# EasyEDA Pro project Drone.eprj, schematic Schematic1, sheets 2 to 4 of 9

## Sheets
2 Memories: Create Date: 2025-06-16; Page Name: Memories; Update Date: 2025-07-30
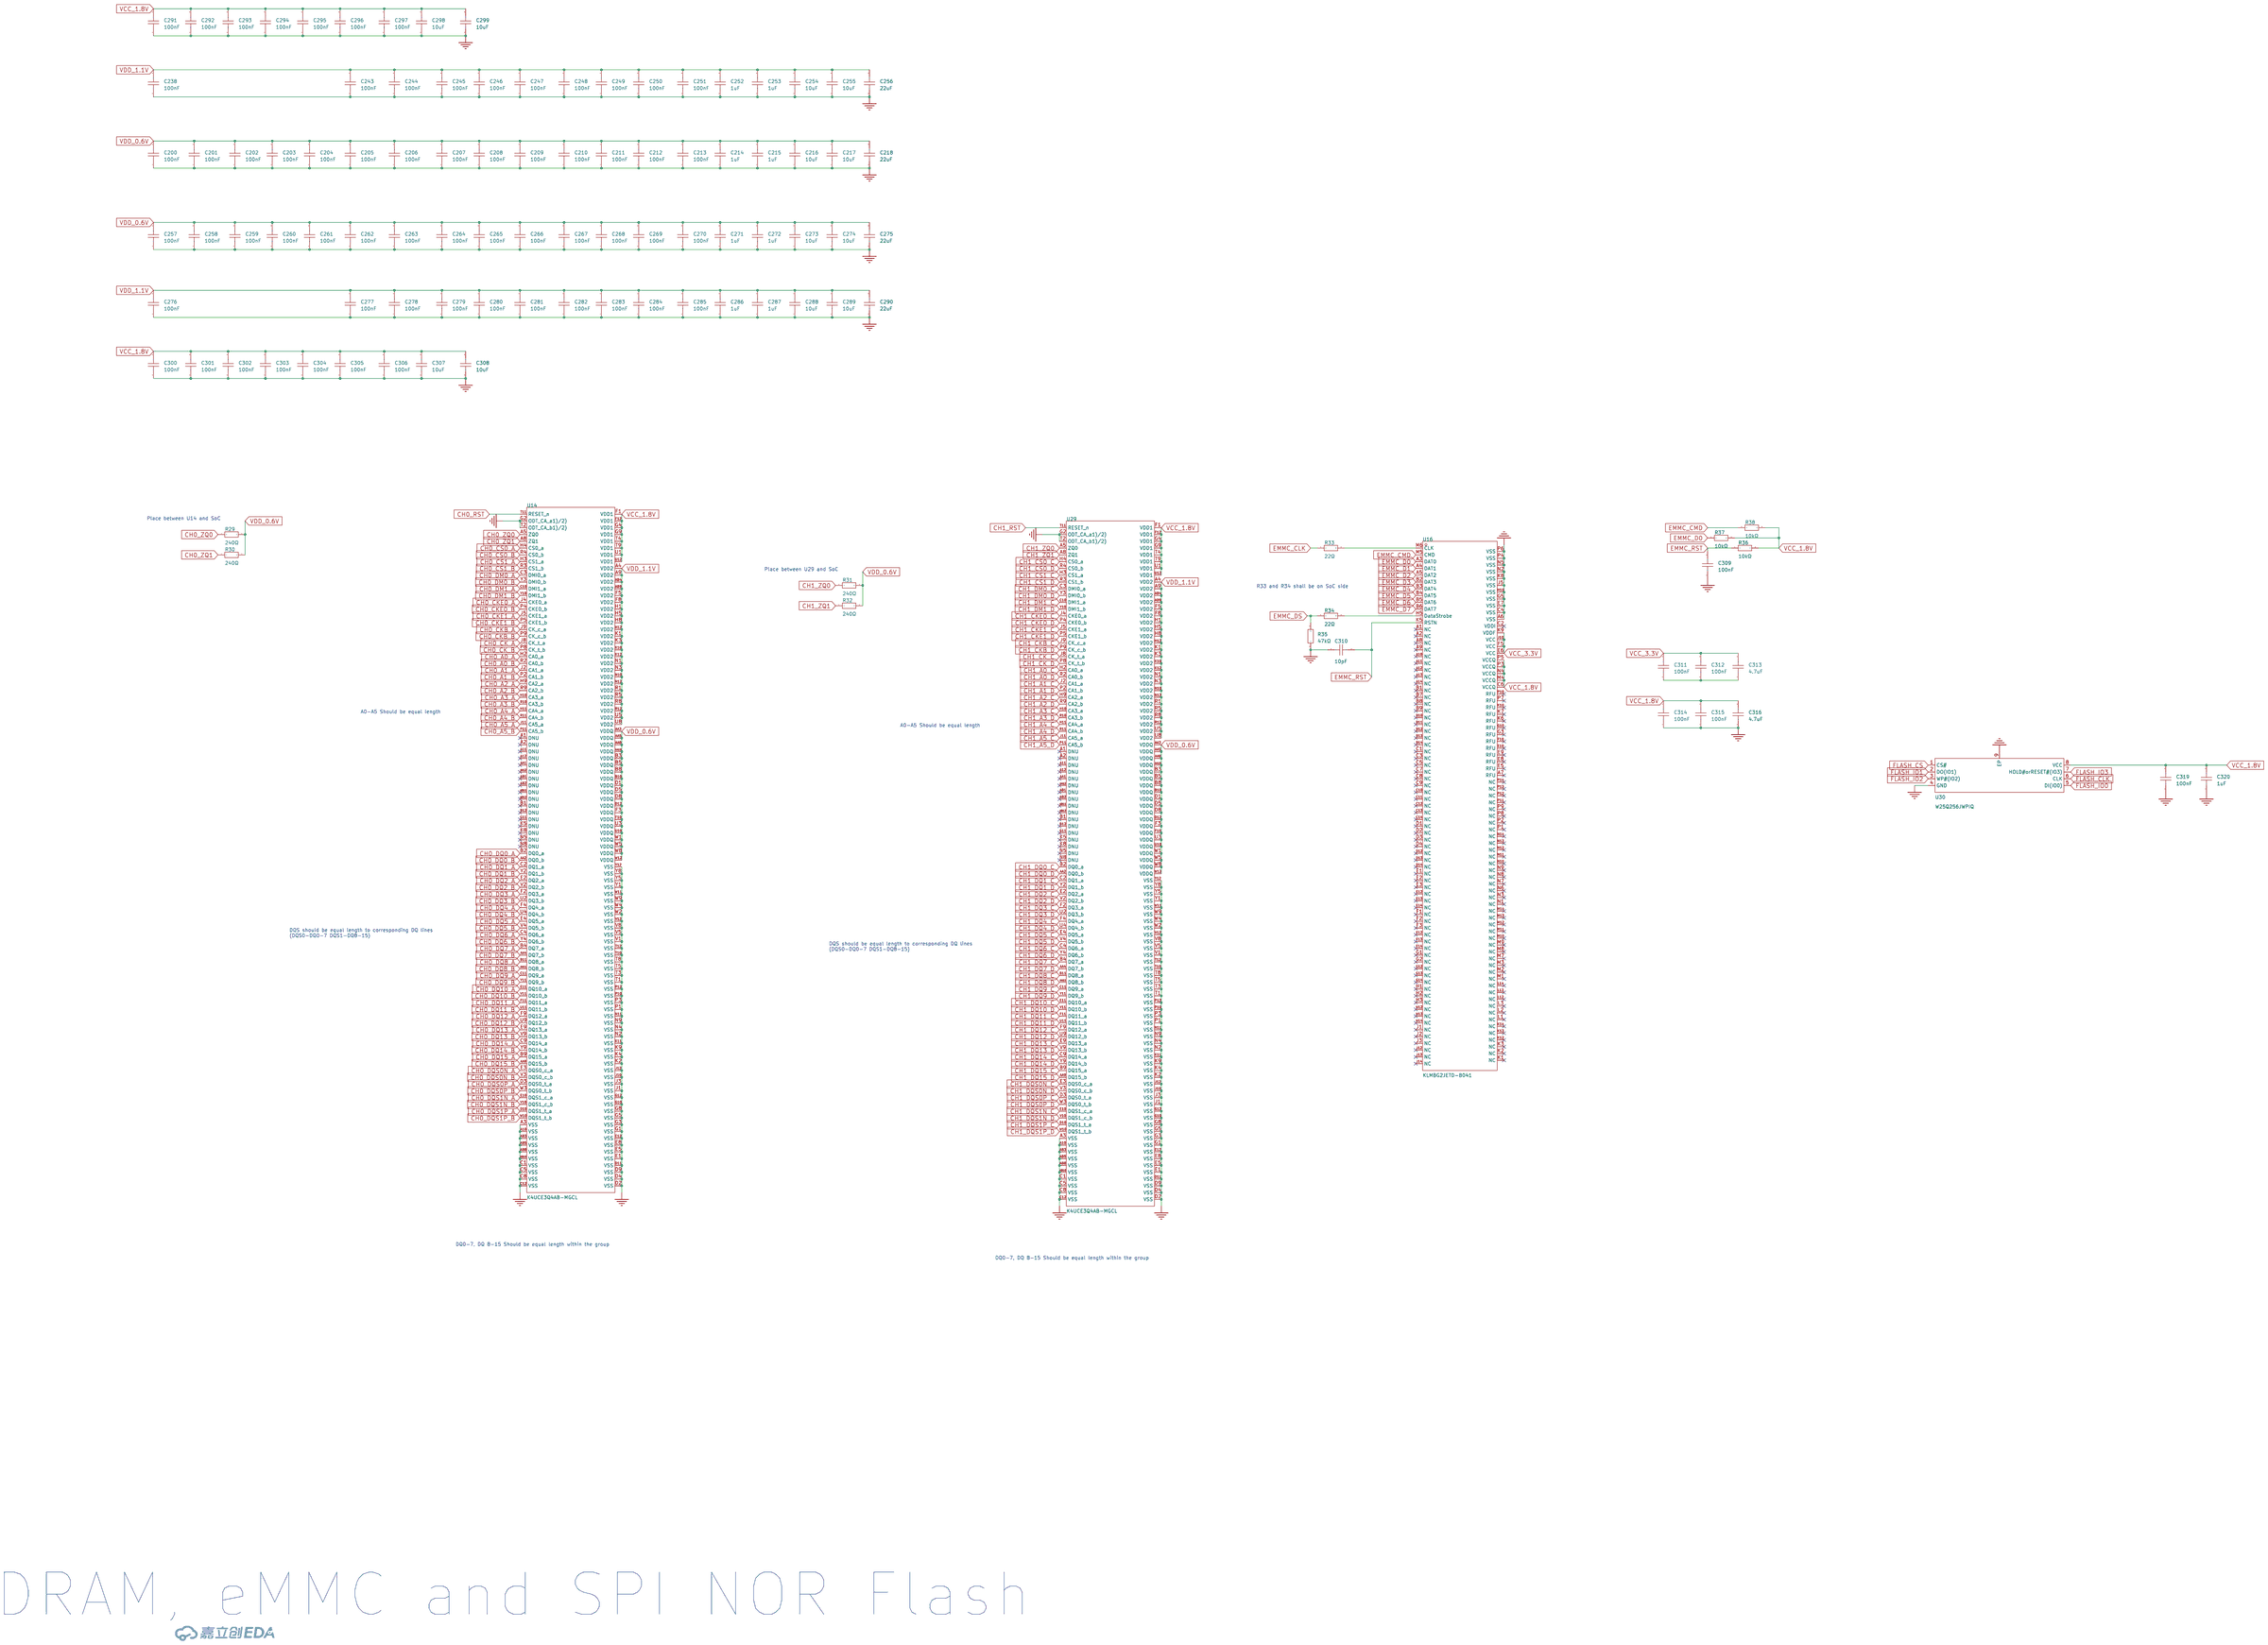
[diagram p1: Memories]
3 RTC and Crystal: Create Date: 2025-06-16; Page Name: RTC and Crystal; Update Date: 2025-07-29
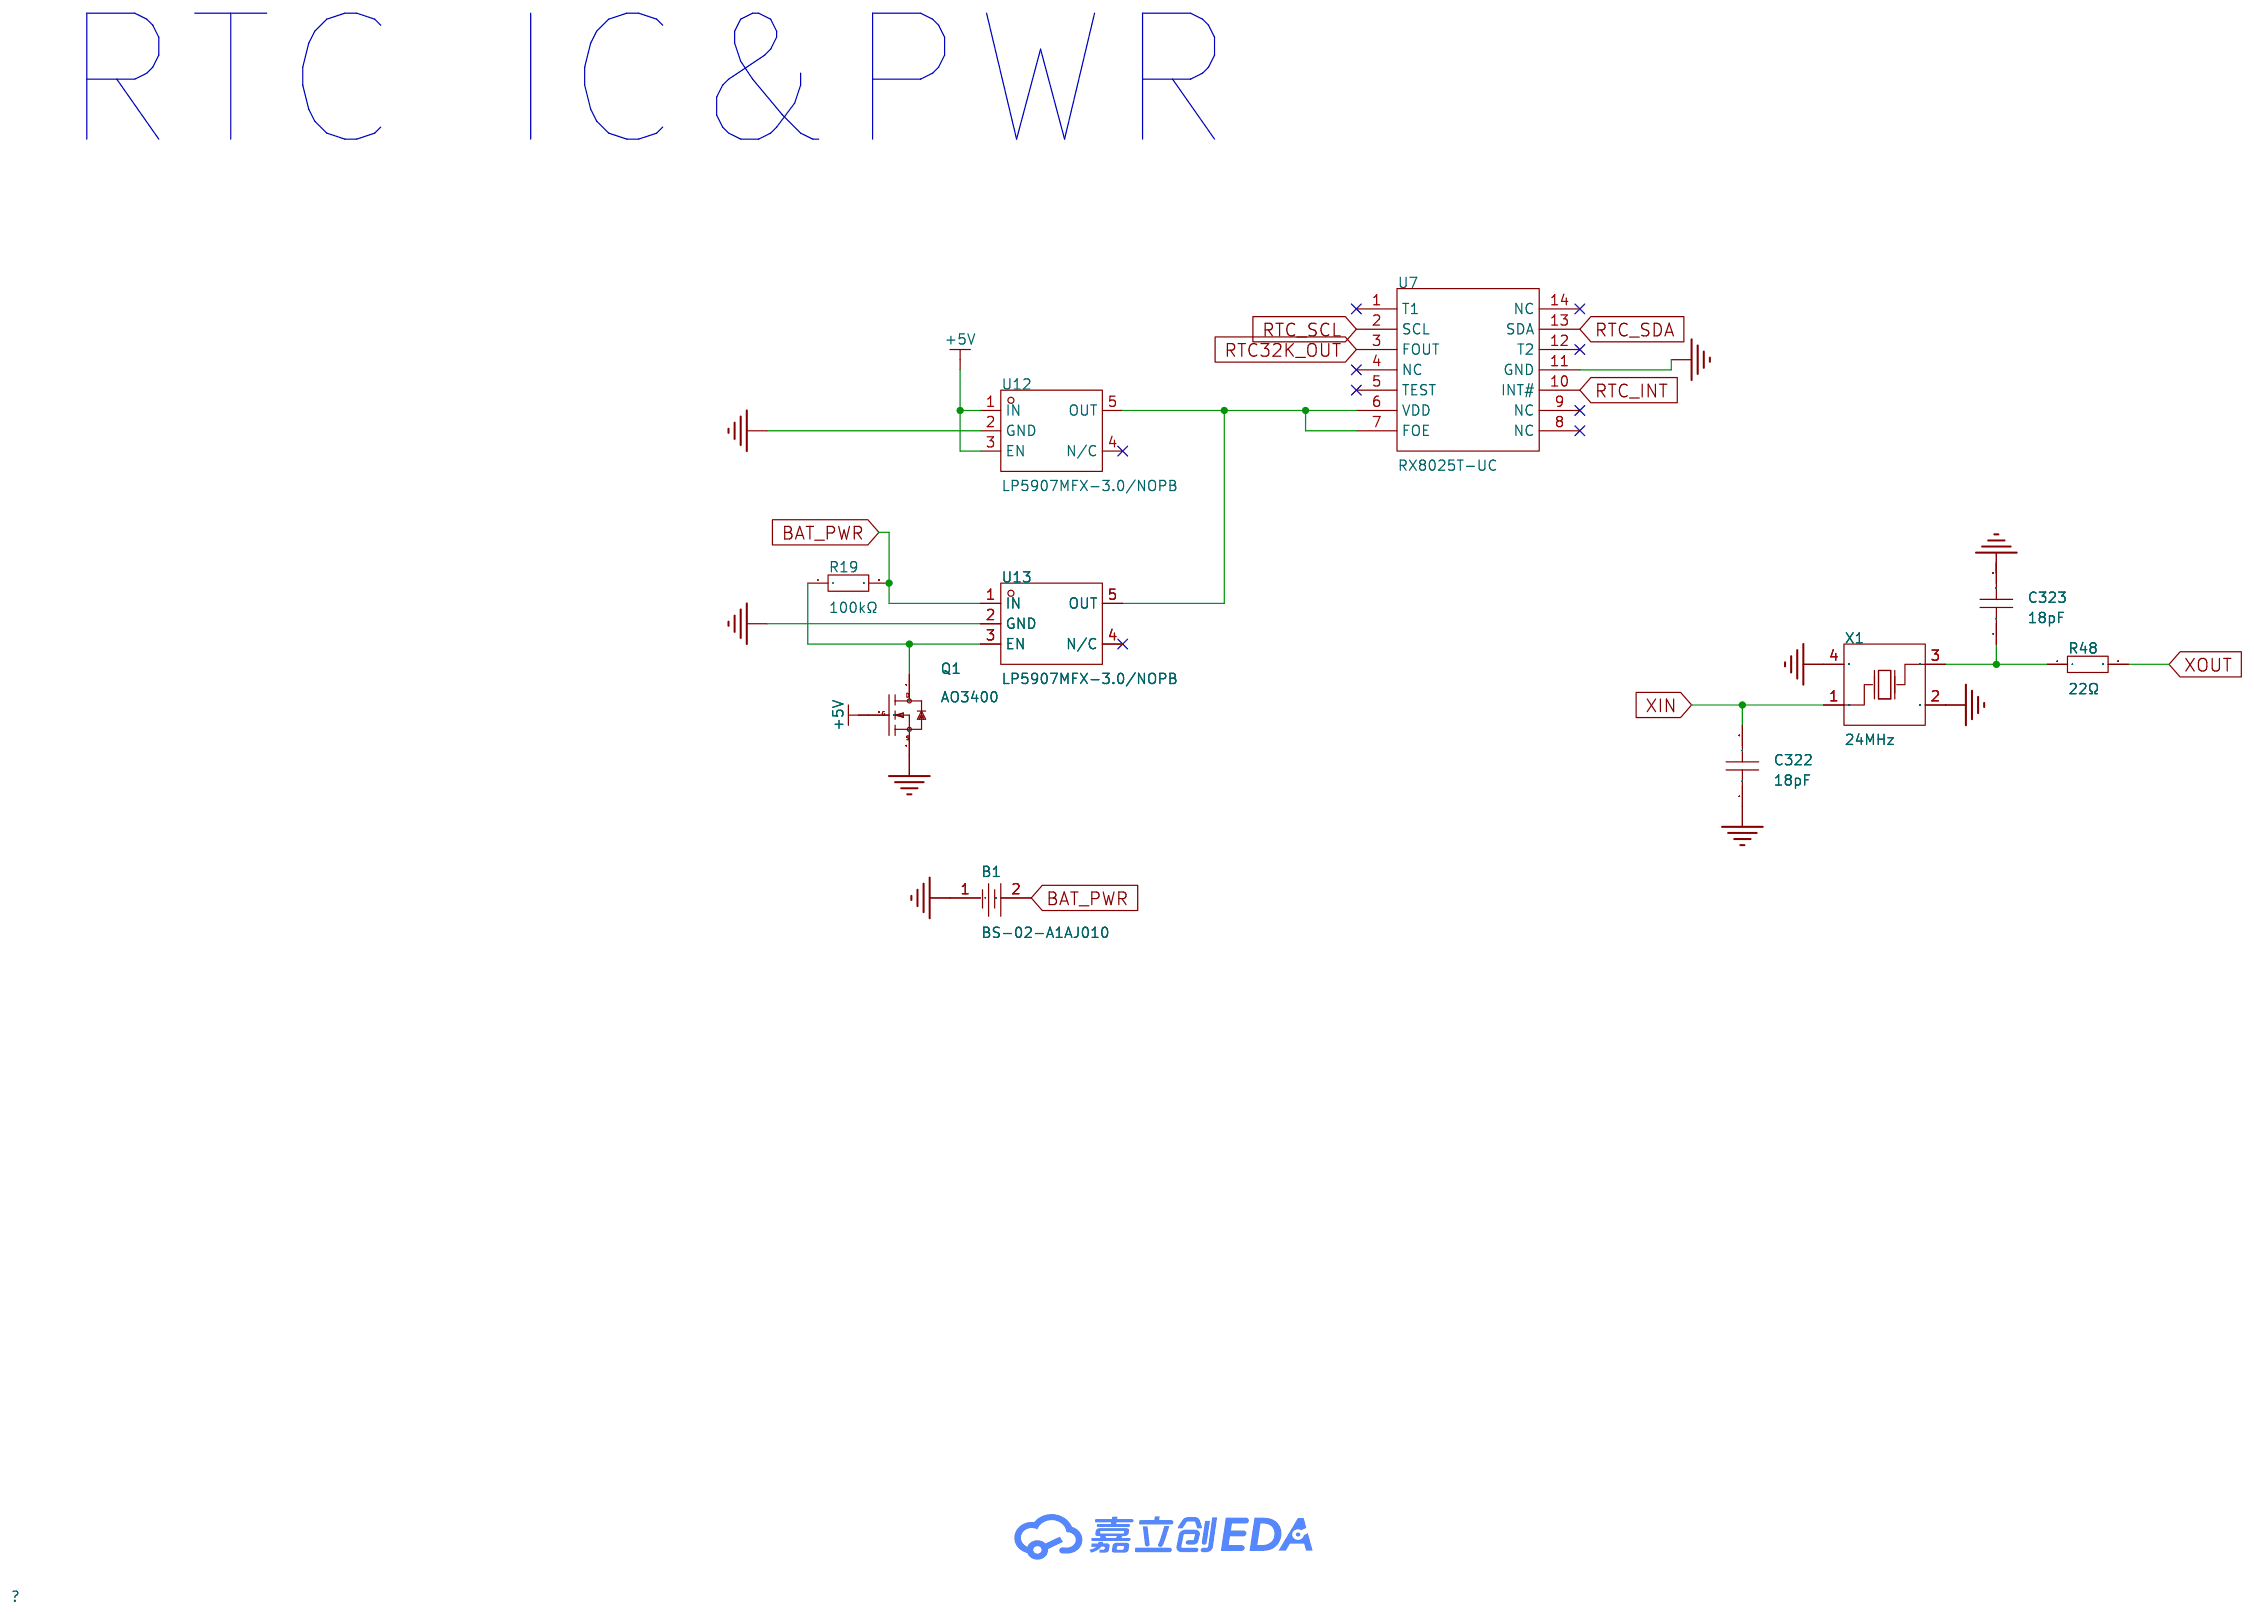
[diagram p2: RTC and Crystal]
4 Main Power ICs: Create Date: 2025-06-17; Page Name: Main Power ICs; Update Date: 2025-08-09
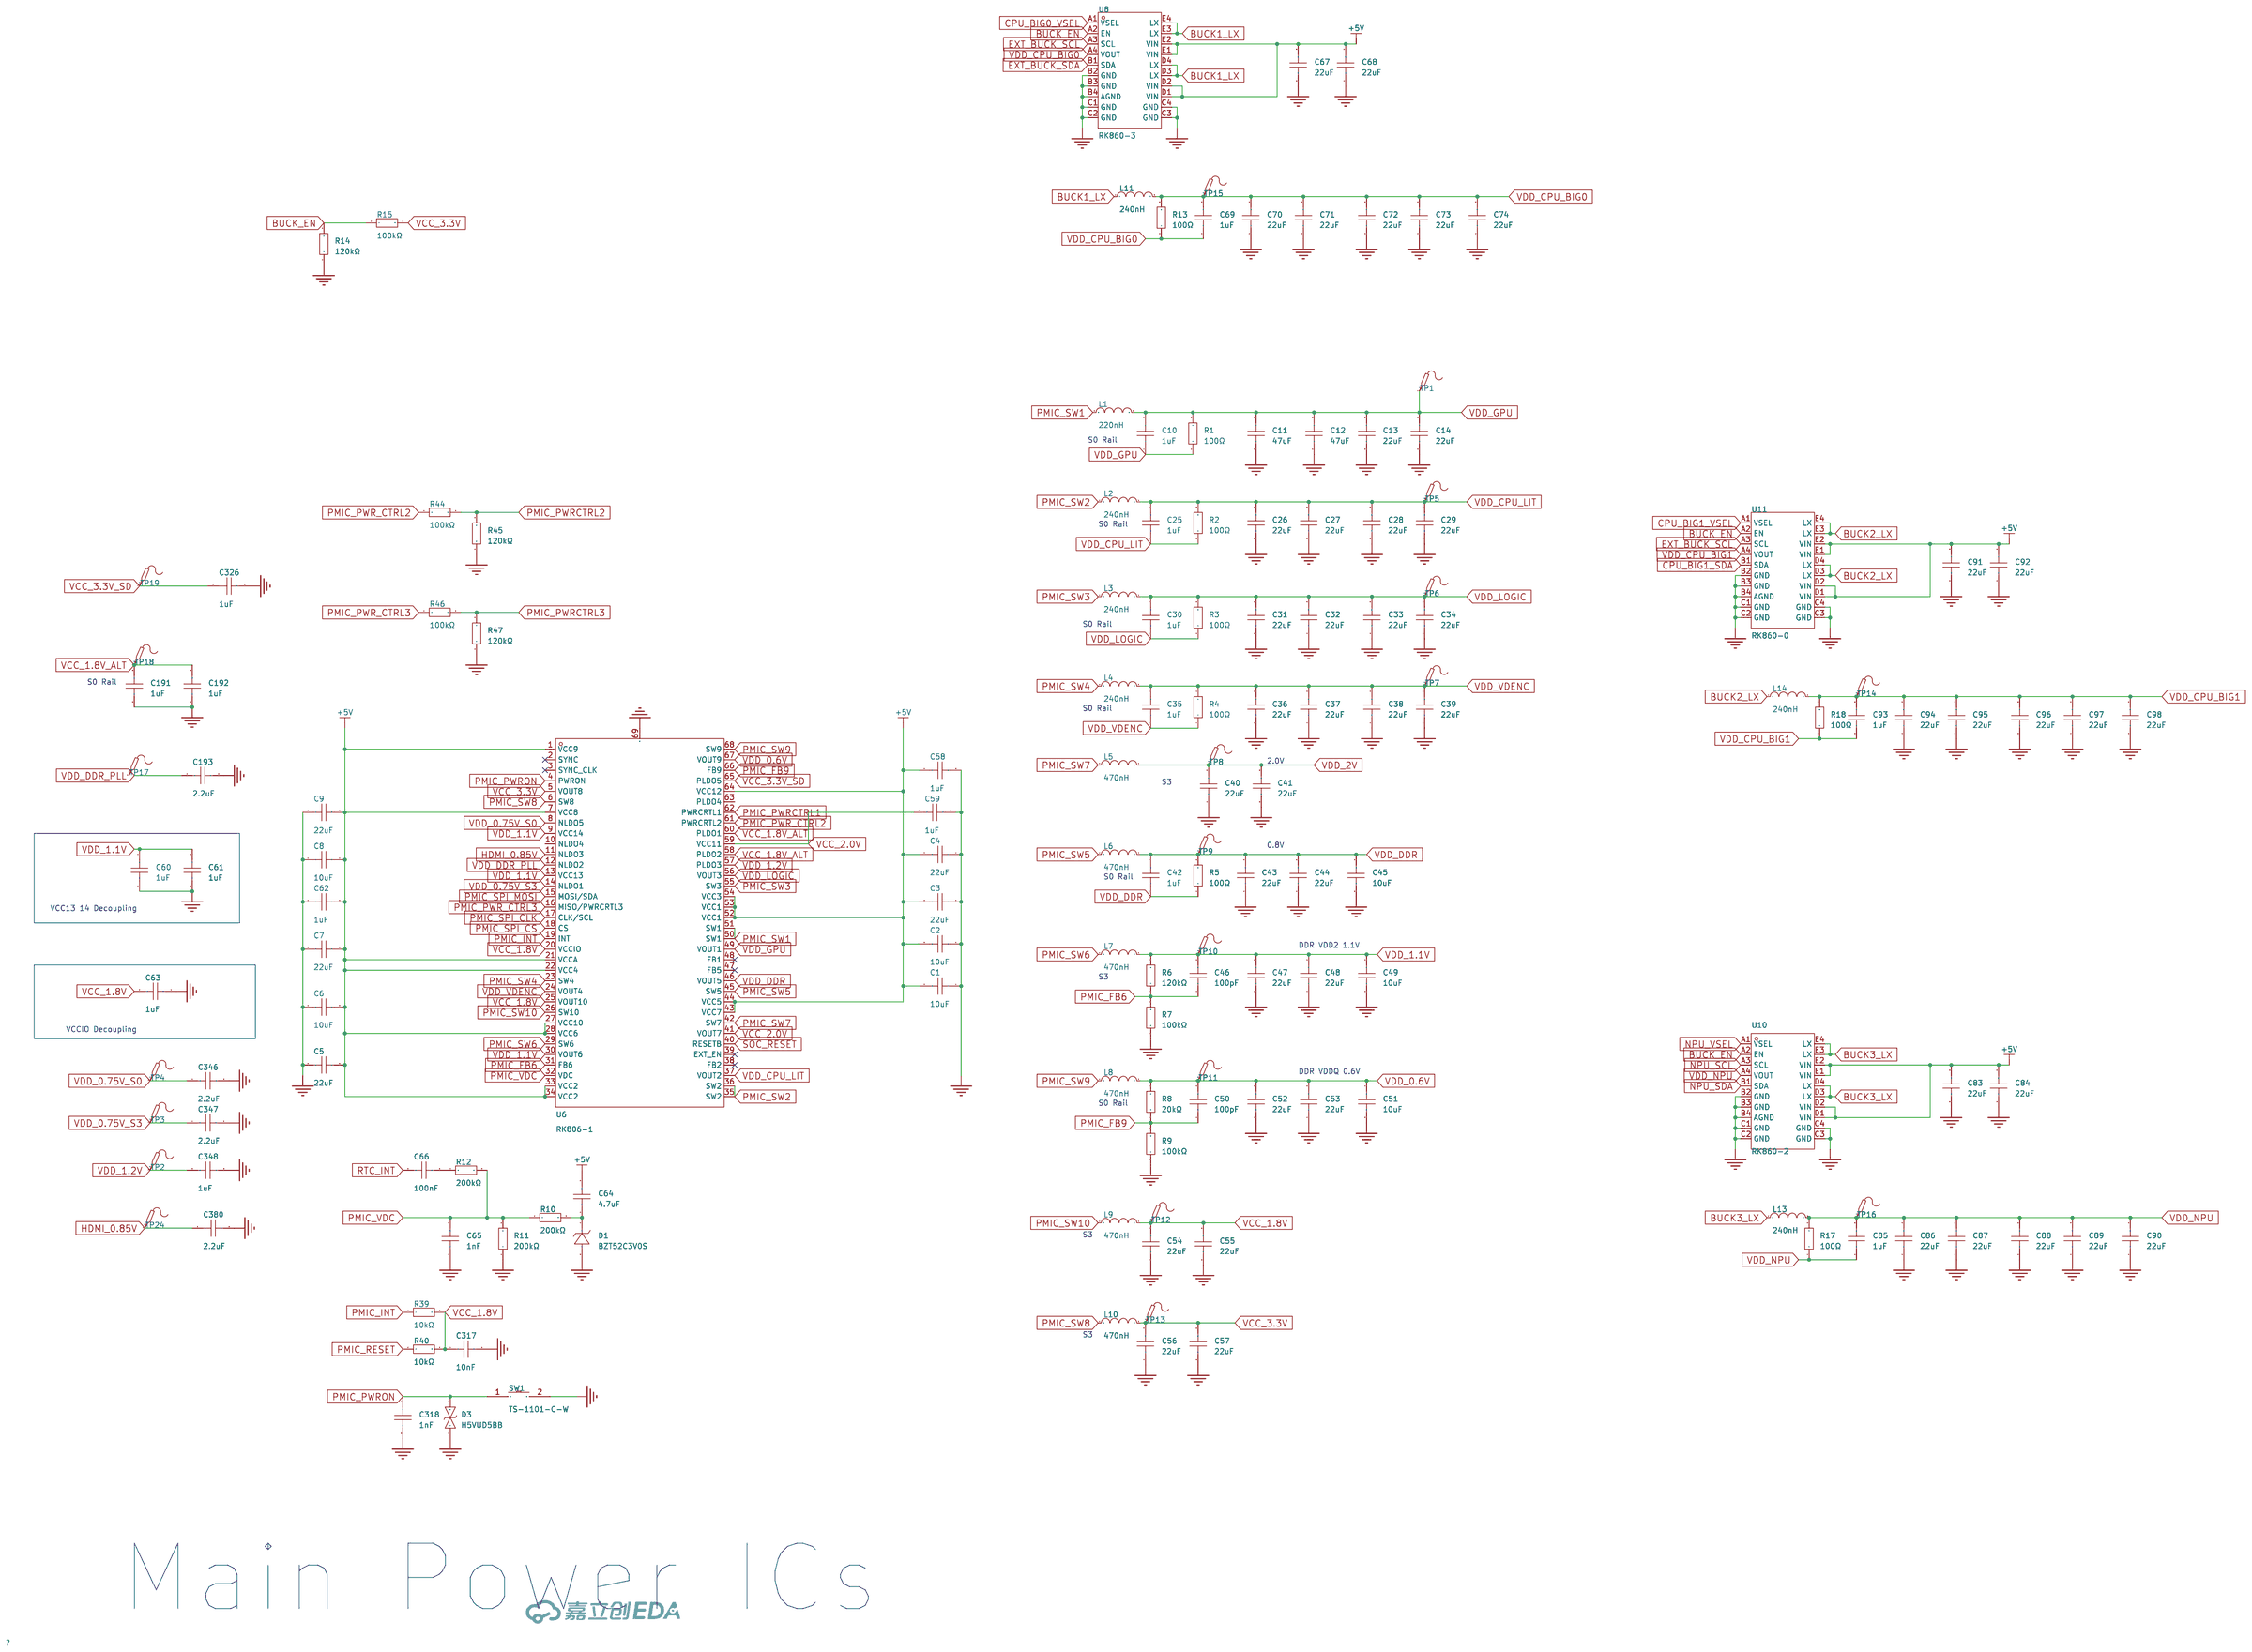
[diagram p3: Main Power ICs]

## Parts
sheet Main Power ICs
C1  10uF  [C0402]
C2  10uF  [C0402]
C3  22uF  [C0402]
C4  22uF  [C0402]
C5  22uF  [C0402]
C6  10uF  [C0402]
C7  22uF  [C0402]
C8  10uF  [C0402]
C9  22uF  [C0402]
C10  1uF  [C0201]
C11  47uF  [C0603]
C12  47uF  [C0603]
C13  22uF  [C0402]
C14  22uF  [C0402]
C25  1uF  [C0201]
C26  22uF  [C0402]
C27  22uF  [C0402]
C28  22uF  [C0402]
C29  22uF  [C0402]
C30  1uF  [C0201]
C31  22uF  [C0402]
C32  22uF  [C0402]
C33  22uF  [C0402]
C34  22uF  [C0402]
C35  1uF  [C0201]
C36  22uF  [C0402]
C37  22uF  [C0402]
C38  22uF  [C0402]
C39  22uF  [C0402]
C40  22uF  [C0402]
C41  22uF  [C0402]
C42  1uF  [C0201]
C43  22uF  [C0402]
C44  22uF  [C0402]
C45  10uF  [C0402]
C46  100pF  [C01005]
C47  22uF  [C0402]
C48  22uF  [C0402]
C49  10uF  [C0402]
C50  100pF  [C01005]
C51  10uF  [C0402]
C52  22uF  [C0402]
C53  22uF  [C0402]
C54  22uF  [C0402]
C55  22uF  [C0402]
C56  22uF  [C0402]
C57  22uF  [C0402]
C58  1uF  [C0201]
C59  1uF  [C0201]
C60  1uF  [C0201]
C61  1uF  [C0201]
C62  1uF  [C0201]
C63  1uF  [C0201]
C64  4.7uF  [C0201]
C65  1nF  [C0201]
C66  100nF  [C01005]
C67  22uF  [C0402]
C68  22uF  [C0402]
C69  1uF  [C0201]
C70  22uF  [C0402]
C71  22uF  [C0402]
C72  22uF  [C0402]
C73  22uF  [C0402]
C74  22uF  [C0402]
C83  22uF  [C0402]
C84  22uF  [C0402]
C85  1uF  [C0201]
C86  22uF  [C0402]
C87  22uF  [C0402]
C88  22uF  [C0402]
C89  22uF  [C0402]
C90  22uF  [C0402]
C91  22uF  [C0402]
C92  22uF  [C0402]
C93  1uF  [C0201]
C94  22uF  [C0402]
C95  22uF  [C0402]
C96  22uF  [C0402]
C97  22uF  [C0402]
C98  22uF  [C0402]
C191  1uF  [C0201]
C192  1uF  [C0201]
C193  2.2uF  [C0201]
C317  10nF  [C0201]
C318  1nF  [C0201]
C326  1uF  [C0201]
C346  2.2uF  [C0201]
C347  2.2uF  [C0201]
C348  1uF  [C0201]
C380  2.2uF  [C0201]
D1  BZT52C3V0S  [SOD-323_L1.7-W1.3-LS2.6-RD]
D3  H5VUD5BB  [SOD-523_L1.2-W0.8-LS1.6-BI]
L1  220nH  [IND-SMD_L3.2-W2.5_SRP3212]
L2  240nH  [IND-SMD_L2.5-W2.0_MHCHL2520]
L3  240nH  [IND-SMD_L2.5-W2.0_MHCHL2520]
L4  240nH  [IND-SMD_L2.5-W2.0_MHCHL2520]
L5  470nH  [IND-SMD_L2.5-W2.0]
L6  470nH  [IND-SMD_L2.5-W2.0]
L7  470nH  [IND-SMD_L2.5-W2.0]
L8  470nH  [IND-SMD_L2.5-W2.0]
L9  470nH  [IND-SMD_L2.5-W2.0]
L10  470nH  [IND-SMD_L2.5-W2.0]
L11  240nH  [IND-SMD_L2.5-W2.0_MHCHL2520]
L13  240nH  [IND-SMD_L2.5-W2.0_MHCHL2520]
L14  240nH  [IND-SMD_L2.5-W2.0_MHCHL2520]
R1  100Ω  [R0201]
R2  100Ω  [R0201]
R3  100Ω  [R0201]
R4  100Ω  [R0201]
R5  100Ω  [R0201]
R6  120kΩ  [R0201]
R7  100kΩ  [R0201]
R8  20kΩ  [R0201]
R9  100kΩ  [R0201]
R10  200kΩ  [R0201]
R11  200kΩ  [R0201]
R12  200kΩ  [R0201]
R13  100Ω  [R0201]
R14  120kΩ  [R0201]
R15  100kΩ  [R0201]
R17  100Ω  [R0201]
R18  100Ω  [R0201]
R39  10kΩ  [R0201]
R40  10kΩ  [R0201]
R44  100kΩ  [R0201]
R45  120kΩ  [R0201]
R46  100kΩ  [R0201]
R47  120kΩ  [R0201]
SW1  TS-1101-C-W  [SW-SMD_L6.0-W3.3-LS8.0]
TP1  -  [Test-Point-0.5mm]
TP2  -  [Test-Point-0.5mm]
TP3  -  [Test-Point-0.5mm]
TP4  -  [Test-Point-0.5mm]
TP5  -  [Test-Point-0.5mm]
TP6  -  [Test-Point-0.5mm]
TP7  -  [Test-Point-0.5mm]
TP8  -  [Test-Point-0.5mm]
TP9  -  [Test-Point-0.5mm]
TP10  -  [Test-Point-0.5mm]
TP11  -  [Test-Point-0.5mm]
TP12  -  [Test-Point-0.5mm]
TP13  -  [Test-Point-0.5mm]
TP14  -  [Test-Point-0.5mm]
TP15  -  [Test-Point-0.5mm]
TP16  -  [Test-Point-0.5mm]
TP17  -  [Test-Point-0.5mm]
TP18  -  [Test-Point-0.5mm]
TP19  -  [Test-Point-0.5mm]
TP24  -  [Test-Point-0.5mm]
U6  RK806-1  [QFN-68_L7.0-W7.0-P0.35-BL-EP5.5]
U8  RK860-3  [WLCSP-20_L2.0-W1.6-R5-C4-P0.40-TL]
U10  RK860-2  [WLCSP-20_L2.0-W1.6-R5-C4-P0.40-TL]
U11  RK860-0  [WLCSP-20_L2.0-W1.6-R5-C4-P0.40-TL]
sheet Memories
C200  100nF  [C01005]
C201  100nF  [C01005]
C202  100nF  [C01005]
C203  100nF  [C01005]
C204  100nF  [C01005]
C205  100nF  [C01005]
C206  100nF  [C01005]
C207  100nF  [C01005]
C208  100nF  [C01005]
C209  100nF  [C01005]
C210  100nF  [C01005]
C211  100nF  [C01005]
C212  100nF  [C01005]
C213  100nF  [C01005]
C214  1uF  [C0201]
C215  1uF  [C0201]
C216  10uF  [C0402]
C217  10uF  [C0402]
C218  22uF  [C0402]
C238  100nF  [C01005]
C243  100nF  [C01005]
C244  100nF  [C01005]
C245  100nF  [C01005]
C246  100nF  [C01005]
C247  100nF  [C01005]
C248  100nF  [C01005]
C249  100nF  [C01005]
C250  100nF  [C01005]
C251  100nF  [C01005]
C252  1uF  [C0201]
C253  1uF  [C0201]
C254  10uF  [C0402]
C255  10uF  [C0402]
C256  22uF  [C0402]
C257  100nF  [C01005]
C258  100nF  [C01005]
C259  100nF  [C01005]
C260  100nF  [C01005]
C261  100nF  [C01005]
C262  100nF  [C01005]
C263  100nF  [C01005]
C264  100nF  [C01005]
C265  100nF  [C01005]
C266  100nF  [C01005]
C267  100nF  [C01005]
C268  100nF  [C01005]
C269  100nF  [C01005]
C270  100nF  [C01005]
C271  1uF  [C0201]
C272  1uF  [C0201]
C273  10uF  [C0402]
C274  10uF  [C0402]
C275  22uF  [C0402]
C276  100nF  [C01005]
C277  100nF  [C01005]
C278  100nF  [C01005]
C279  100nF  [C01005]
C280  100nF  [C01005]
C281  100nF  [C01005]
C282  100nF  [C01005]
C283  100nF  [C01005]
C284  100nF  [C01005]
C285  100nF  [C01005]
C286  1uF  [C0201]
C287  1uF  [C0201]
C288  10uF  [C0402]
C289  10uF  [C0402]
C290  22uF  [C0402]
C291  100nF  [C01005]
C292  100nF  [C01005]
C293  100nF  [C01005]
C294  100nF  [C01005]
C295  100nF  [C01005]
C296  100nF  [C01005]
C297  100nF  [C01005]
C298  10uF  [C0402]
C299  10uF  [C0402]
C300  100nF  [C01005]
C301  100nF  [C01005]
C302  100nF  [C01005]
C303  100nF  [C01005]
C304  100nF  [C01005]
C305  100nF  [C01005]
C306  100nF  [C01005]
C307  10uF  [C0402]
C308  10uF  [C0402]
C309  100nF  [C01005]
C310  10pF  [C0201]
C311  100nF  [C01005]
C312  100nF  [C01005]
C313  4.7uF  [C0201]
C314  100nF  [C01005]
C315  100nF  [C01005]
C316  4.7uF  [C0201]
C319  100nF  [C0201]
C320  1uF  [C0201]
R29  240Ω  [R0201]
R30  240Ω  [R0201]
R31  240Ω  [R0201]
R32  240Ω  [R0201]
R33  22Ω  [R0201]
R34  22Ω  [R0201]
R35  47kΩ  [R0201]
R36  10kΩ  [R0201]
R37  10kΩ  [R0201]
R38  10kΩ  [R0201]
U14  K4UCE3Q4AB-MGCL  [FBGA-200_L15.0-W10.0-BL_RS512M32LO4D1BDS-53BT]
U16  KLMBG2JETD-B041  [FBGA-153_L13.0-W11.5-P0.50_KLMAG1JETD-B041]
U29  K4UCE3Q4AB-MGCL  [FBGA-200_L15.0-W10.0-BL_RS512M32LO4D1BDS-53BT]
U30  W25Q256JWPIQ  [WSON-8_L6.0-W5.0-P1.27-TL-EP]
sheet RTC and Crystal
B1  BS-02-A1AJ010  [BAT-TH_BS-02-A1AJ010]
C322  18pF  [C0201]
C323  18pF  [C0201]
Q1  AO3400  [SOT-23-3_L2.9-W1.3-P1.90-LS2.4-BR]
R19  100kΩ  [R0201]
R48  22Ω  [R0201]
U7  RX8025T-UC  [SOIC-14_L10.1-W5.0-P1.27-LS7.4-BL]
U12  LP5907MFX-3.0/NOPB  [SOT-23-5_L3.0-W1.7-P0.95-LS2.8-BL]
U13  LP5907MFX-3.0/NOPB  [SOT-23-5_L3.0-W1.7-P0.95-LS2.8-BL]
X1  24MHz  [CRYSTAL-SMD_4P-L3.2-W2.5-BL]

## Library data of the parts
C1 C2 C6 C8 C45 C49 C51 = HGC0402R5106M100NTEJ: LCSC Part Name: 10uF ±20% 10V; Supplier Part: C7472949; Manufacturer: Chinocera(华瓷); Supplier Footprint: 0402; JLCPCB Part Class: Extended Part; Datasheet: https://atta.szlcsc.com/upload/public/pdf/source/20240320/FAC3FEC40A78BC5CCCE96C232A94D860.pdf; Supplier: LCSC; Tolerance: ±20%; Voltage Rated: 10V; Temperature Coefficient: X5R
C3-C5 C7 C9 C13 C14 C26-C29 C31-C34 C36-C41 C43 C44 C47 C48 C52-C57 C67 C68 C70-C74 C83 C84 C86-C92 C94-C98 C218 C256 C275 C290 = GRM155R60J226ME11D: LCSC Part Name: 22uF ±20% 6.3V; Supplier Part: C415703; Manufacturer: muRata(村田); Supplier Footprint: 0402; JLCPCB Part Class: Extended Part; Datasheet: https://atta.szlcsc.com/upload/public/pdf/source/20200305/C490387_23319AE8C154DEB24C505E6C82A8106A.pdf; Supplier: LCSC; Tolerance: ±20%; Voltage Rating: 6.3V; Temperature Coefficient: X5R
C10 C25 C30 C35 C42 C58-C63 C69 C85 C93 C191 C192 C214 C215 C252 C253 C271 C272 C286 C287 C320 C326 C348 = GRM033R61A105ME44D: LCSC Part Name: 1uF ±20% 10V; Supplier Part: C76935; Manufacturer: muRata(村田); Supplier Footprint: 0201; JLCPCB Part Class: Extended Part; Datasheet: https://atta.szlcsc.com/upload/public/pdf/source/20190904/C426118_85E81C7C1F21FC87C5FB6D536E0847B4.pdf; Supplier: LCSC; Tolerance: ±20%; Voltage Rated: 10V; Temperature Coefficient: X5R
C11 C12 = GRM188R60J476ME15D: LCSC Part Name: 47uF ±20% 6.3V; Supplier Part: C140782; Manufacturer: muRata(村田); Supplier Footprint: 0603; JLCPCB Part Class: Extended Part; Datasheet: https://atta.szlcsc.com/upload/public/pdf/source/20171113/C140782_15105612981581115778.pdf; Supplier: LCSC; Tolerance: ±20%; Voltage Rated: 6.3V; Temperature Coefficient: X5R
C46 C50 = GRM0225C1E101GA02L: LCSC Part Name: 100pF ±2% 25V; Supplier Part: C710765; Manufacturer: muRata(村田); Supplier Footprint: 01005; JLCPCB Part Class: Extended Part; Datasheet: https://atta.szlcsc.com/upload/public/pdf/source/20221018/A1E10D6FE8C5587FD1D9266B3C257932.pdf; Supplier: LCSC; Tolerance: ±2%; Voltage Rated: 25V; Temperature Coefficient: C0G
C64 C313 C316 = GRM035R60J475ME15D: LCSC Part Name: 4.7uF ±20% 6.3V; Supplier Part: C335103; Manufacturer: muRata(村田); Supplier Footprint: 0201; JLCPCB Part Class: Extended Part; Datasheet: https://atta.szlcsc.com/upload/public/pdf/source/20200305/C490387_23319AE8C154DEB24C505E6C82A8106A.pdf; Supplier: LCSC; Tolerance: ±20%; Voltage Rating: 6.3V; Temperature Coefficient: X5R
C65 C318 = GRM0335C1E102JA01D: LCSC Part Name: 1nF ±5% 25V; Supplier Part: C161371; Manufacturer: muRata(村田); Supplier Footprint: 0201; JLCPCB Part Class: Extended Part; Datasheet: https://atta.szlcsc.com/upload/public/pdf/source/20180224/C161371_15194365134921363544.pdf; Supplier: LCSC; Tolerance: ±5%; Voltage Rated: 25V; Temperature Coefficient: C0G
C66 C200-C213 C238 C243-C251 C257-C270 C276-C285 C291-C297 C300-C306 C309 C311 C312 C314 C315 = GRM022R61A104KE01L: LCSC Part Name: 100nF ±10% 10V; Supplier Part: C3902316; Manufacturer: muRata(村田); Supplier Footprint: 01005; JLCPCB Part Class: Extended Part; Datasheet: https://atta.szlcsc.com/upload/public/pdf/source/20230811/D83B5EC37FE7C54F2244C4076719DD2E.pdf; Supplier: LCSC; Tolerance: ±10%; Voltage Rated: 10V; Temperature Coefficient: X5R
C193 = CGA0201X5R225M6R3ET: LCSC Part Name: 2.2uF ±20% 6.3V; Supplier Part: C6119760; Manufacturer: HRE(芯声); Supplier Footprint: 0201; JLCPCB Part Class: Extended Part; Supplier: LCSC; Tolerance: ±20%; Voltage Rating: 6.3V; Temperature Coefficient: X5R
C317 = GRM033R71A103KA01D: LCSC Part Name: 10nF ±10% 10V; Supplier Part: C76941; Manufacturer: muRata(村田); Supplier Footprint: 0201; JLCPCB Part Class: Extended Part; Datasheet: https://atta.szlcsc.com/upload/public/pdf/source/20180307/C76941_15204091038901407729.pdf; Supplier: LCSC; Tolerance: ±10%; Voltage Rated: 10V; Temperature Coefficient: X7R
C346 C347 C380 = GRM033R61A225ME47D: LCSC Part Name: 2.2uF ±20% 10V; Supplier Part: C319184; Manufacturer: muRata(村田); Supplier Footprint: 0201; JLCPCB Part Class: Extended Part; Datasheet: https://item.szlcsc.com/datasheet/GRM033R61A225ME47D/300450.html; Supplier: LCSC; Tolerance: ±20%; Voltage Rating: 10V; Temperature Coefficient: X5R
D1 = BZT52C3V0S_C19077436: Supplier Part: C19077436; Manufacturer: 宏迦橙; Supplier Footprint: SOD-323; JLCPCB Part Class: 扩展库; Datasheet: https://atta.szlcsc.com/upload/public/pdf/source/20231117/06CD1C2A69B3FFC97FEAE4263E1B2FE9.pdf; Supplier: LCSC; Diode Configuration: 独立式; Zener Voltage (Nom): 3V; Reverse Leakage Current (Ir): 10uA@1V; Zener Voltage (Range): 2.8V~3.2V; Power Dissipation: 200mW; Zener Impedance (Zzt): 60Ω
D3 = H5VUD5BB: LCSC Part Name: 丝印:5S; Supplier Part: C20615820; Manufacturer: 宏迦橙; Supplier Footprint: SOD-523; JLCPCB Part Class: 扩展库; Datasheet: https://atta.szlcsc.com/upload/public/pdf/source/20240403/C7286ECF6740AC5EA5B85BA138DAD7E0.pdf; Supplier: LCSC; polarity: 双向; Reverse Stand-Off Voltage (Vrwm): 5V; Maximum Clamping Voltage: 25V; Peak Pulse Current (Ipp): 5A; Peak Pulse Power Dissipation (Ppp): 125W; Breakdown Voltage: 10V; Reverse Leakage Current (Ir): 200nA; Operating Temperature: -55℃~+155℃; Type: ESD
L1 = FTC322512SR22MBCA: LCSC Part Name: 220nH ±20% 11.5A; Supplier Part: C5832378; Manufacturer: cjiang(长江微电); Supplier Footprint: SMD,2.5x3.2mm; JLCPCB Part Class: Extended Part; Datasheet: https://atta.szlcsc.com/upload/public/pdf/source/20230602/8FFEDA9C0247A92A0D4B67554BFE4091.pdf; Supplier: LCSC; Tolerance: ±20%; Rated Current: 9.2A; Saturation Current (Isat): 11.5A; DC Resistance (DCR): 6.6mΩ; Type: 一体成型电感
L2-L4 L11 L13 L14 = FTC252012SR24MBCA: LCSC Part Name: 240nH ±20% 9.3A; Supplier Part: C5832366; Manufacturer: cjiang(长江微电); Supplier Footprint: SMD,2x2.5mm; JLCPCB Part Class: Extended Part; Datasheet: https://atta.szlcsc.com/upload/public/pdf/source/20230602/8FFEDA9C0247A92A0D4B67554BFE4091.pdf; Supplier: LCSC; Tolerance: ±20%; Rated Current: 8A; Saturation Current (Isat): 9.3A; DC Resistance (DCR): 10mΩ; Type: 一体成型电感
L5-L10 = FTC252012SR47MBCA: LCSC Part Name: 470nH ±20% 7.5A; Supplier Part: C5832368; Manufacturer: cjiang(长江微电); Supplier Footprint: SMD,2x2.5mm; JLCPCB Part Class: Extended Part; Datasheet: https://atta.szlcsc.com/upload/public/pdf/source/20230602/8FFEDA9C0247A92A0D4B67554BFE4091.pdf; Supplier: LCSC; Tolerance: ±20%; Rated Current: 6.5A; Saturation Current (Isat): 7.5A; DC Resistance (DCR): 13mΩ; Type: 一体成型电感
R1-R5 = 0201WMF1000TEE: LCSC Part Name: 100Ω ±1% 50mW 厚膜电阻; Supplier Part: C270366; Manufacturer: UNI-ROYAL(厚声); Supplier Footprint: 0201; JLCPCB Part Class: Extended Part; Datasheet: https://atta.szlcsc.com/upload/public/pdf/source/20200306/C422600_1E6D84923E4A46A82E41ADD87F860B5C.pdf; Supplier: LCSC; Type: 厚膜电阻; Tolerance: ±1%; Power(Watts): 50mW; Overload Voltage (Max): 25V; Temperature Coefficient: ±200ppm/℃; Operating Temperature Range: -55℃~+155℃
R6 = RC0201FR-07120KL: LCSC Part Name: 厚膜电阻 120kΩ ±1% 50mW; Supplier Part: C274344; Manufacturer: YAGEO(国巨); Supplier Footprint: 0201; JLCPCB Part Class: Extended Part; Datasheet: https://atta.szlcsc.com/upload/public/pdf/source/20180821/C275644_0D56F95EFF785E7D9A1FEF436B37DA78.pdf; Supplier: LCSC; Type: 厚膜电阻; Tolerance: ±1%; Power(Watts): 50mW; Overload Voltage (Max): 25V; Temperature Coefficient: ±200ppm/℃; Operating Temperature Range: -55℃~+125℃
R7 R9 R15 R19 R44 R46 = 0201WMF1003TEE: LCSC Part Name: 100kΩ ±1% 50mW 厚膜电阻; Supplier Part: C270364; Manufacturer: UNI-ROYAL(厚声); Supplier Footprint: 0201; JLCPCB Part Class: Extended Part; Datasheet: https://atta.szlcsc.com/upload/public/pdf/source/20200306/C422600_1E6D84923E4A46A82E41ADD87F860B5C.pdf; Supplier: LCSC; Type: 厚膜电阻; Tolerance: ±1%; Power(Watts): 50mW; Overload Voltage (Max): 25V; Temperature Coefficient: ±200ppm/℃; Operating Temperature Range: -55℃~+155℃
R8 = 0201WMF2002TEE: LCSC Part Name: 20kΩ ±1% 50mW 厚膜电阻; Supplier Part: C473466; Manufacturer: UNI-ROYAL(厚声); Supplier Footprint: 0201; JLCPCB Part Class: Extended Part; Datasheet: https://atta.szlcsc.com/upload/public/pdf/source/20200306/C422600_1E6D84923E4A46A82E41ADD87F860B5C.pdf; Supplier: LCSC; Type: 厚膜电阻; Tolerance: ±1%; Power(Watts): 50mW; Overload Voltage (Max): 25V; Temperature Coefficient: ±200ppm/℃; Operating Temperature Range: -55℃~+155℃
R10-R12 = RC0201FR-07200KL: LCSC Part Name: 厚膜电阻 200kΩ ±1% 50mW; Supplier Part: C138163; Manufacturer: YAGEO(国巨); Supplier Footprint: 0201; JLCPCB Part Class: Extended Part; Datasheet: https://atta.szlcsc.com/upload/public/pdf/source/20181009/C309620_DA5935B6E1D48212CB7A533FE518B3C2.pdf; Supplier: LCSC; Type: 厚膜电阻; Tolerance: ±1%; Power(Watts): 50mW; Overload Voltage (Max): 25V; Temperature Coefficient: ±200ppm/℃; Operating Temperature Range: -55℃~+125℃
R13 R17 R18 = RC0201FR-07100RL: LCSC Part Name: 厚膜电阻 100Ω ±1% 50mW; Supplier Part: C77623; Manufacturer: YAGEO(国巨); Supplier Footprint: 0201; JLCPCB Part Class: Extended Part; Datasheet: https://atta.szlcsc.com/upload/public/pdf/source/20181009/C309620_DA5935B6E1D48212CB7A533FE518B3C2.pdf; Supplier: LCSC; Type: 厚膜电阻; Tolerance: ±1%; Power(Watts): 50mW; Overload Voltage (Max): 25V; Temperature Coefficient: ±200ppm/℃; Operating Temperature Range: -55℃~+125℃
R14 = 0201WMF1203TEE: LCSC Part Name: 120kΩ ±1% 50mW 厚膜电阻; Supplier Part: C270362; Manufacturer: UNI-ROYAL(厚声); Supplier Footprint: 0201; JLCPCB Part Class: Extended Part; Datasheet: https://atta.szlcsc.com/upload/public/pdf/source/20200306/C422600_1E6D84923E4A46A82E41ADD87F860B5C.pdf; Supplier: LCSC; Type: 厚膜电阻; Tolerance: ±1%; Power(Watts): 50mW; Overload Voltage (Max): 25V; Temperature Coefficient: ±200ppm/℃; Operating Temperature Range: -55℃~+155℃
R36-R40 = 0201WMF1002TEE: LCSC Part Name: 10kΩ ±1% 50mW 厚膜电阻; Supplier Part: C473048; Manufacturer: UNI-ROYAL(厚声); Supplier Footprint: 0201; JLCPCB Part Class: Extended Part; Datasheet: https://atta.szlcsc.com/upload/public/pdf/source/20200306/C422600_1E6D84923E4A46A82E41ADD87F860B5C.pdf; Supplier: LCSC; Type: 厚膜电阻; Tolerance: ±1%; Power(Watts): 50mW; Overload Voltage (Max): 25V; Temperature Coefficient: ±200ppm/℃; Operating Temperature Range: -55℃~+155℃
R45 R47 = 0201WMF1203TEE: 电阻类型:厚膜电阻;阻值:120kΩ;精度:±1%;功率:50mW;工作电压:25V;温度系数:±200ppm/℃;; LCSC Part Name: 120kΩ ±1% 50mW 厚膜电阻; Supplier Part: C270362; Manufacturer: UNI-ROYAL(厚声); Supplier Footprint: 0201; JLCPCB Part Class: Extended Part; Datasheet: https://atta.szlcsc.com/upload/public/pdf/source/20200306/C422600_1E6D84923E4A46A82E41ADD87F860B5C.pdf; Supplier: LCSC; Type: 厚膜电阻; Tolerance: ±1%; Power(Watts): 50mW; Overload Voltage (Max): 25V; Temperature Coefficient: ±200ppm/℃; Operating Temperature Range: -55℃~+155℃; Voltage-Supply(Max): 25V; Operating Temperature: -55℃~+155℃
SW1 = TS-1101-C-W: LCSC Part Name: 6*3.6*2.5mm 立贴 轻触开关; Supplier Part: C318938; Manufacturer: XKB Connectivity(中国星坤); Supplier Footprint: SMD; JLCPCB Part Class: 扩展库; Datasheet: https://atta.szlcsc.com/upload/public/pdf/source/20200227/C318938_C2E53B1EEDE37D980A33616AC086DE53.pdf; Supplier: LCSC; Circuit: 单刀单掷; Actuator Style: 矩形按钮; Operating Force: 260gf; Mounting Style: 立贴; Switch Length: 6mm; Switch Width: 3.6mm; Switch Height: 2.5mm; Strike Gundam: 不带; Contact Current: 50mA; Voltage Rating (DC): 12V; Actuator/Cap Color: 白色带淡绿; With Lamp: 无; Mechanical Life: 5万次; Operating Temperature: -30℃~+85℃
TP1-TP19 = Test-Point: Check: false
TP24 = Test-Point
U6 = RK806-1_C5156483: Supplier Part: C5156483; Manufacturer: Rockchip(瑞芯微); Supplier Footprint: QFN-68(7x7); JLCPCB Part Class: 扩展库; Datasheet: https://atta.szlcsc.com/upload/public/pdf/source/20240126/65179706C318B50B43978A8DF1ADA832.pdf; Supplier: LCSC
U8 = RK860-3: Supplier Part: C5156487; Manufacturer: Rockchip(瑞芯微); Supplier Footprint: WLCSP-20; JLCPCB Part Class: 扩展库; Datasheet: https://atta.szlcsc.com/upload/public/pdf/source/20240126/06FA5573652A4038E914693A04ECCFD7.pdf; Supplier: LCSC; Input Voltage: 2.7V~5.5V; Output Current: 7A; Switching Frequency: 2.4MHz; Operating Temperature: -40℃~+125℃@(TJ); Number of Outputs: 1
U10 = RK860-2: Supplier Part: C5156489; Manufacturer: Rockchip(瑞芯微); Supplier Footprint: WLCSP-20; JLCPCB Part Class: Extended Part; Datasheet: https://atta.szlcsc.com/upload/public/pdf/source/20240126/06FA5573652A4038E914693A04ECCFD7.pdf; Supplier: LCSC; Function: 降压型; Voltage - Supply: 2.7V~5.5V; Output Current: 7A; Frequency - Switching: 2.4MHz; Operating Temperature: -40℃~+125℃@(TJ); Number of Outputs: 1; Topology: 降压式
U11 = RK860-0: LCSC Part Name: 高效率2.4MHz同步降压DC-DC调节器; Supplier Part: C19188628; Manufacturer: Rockchip(瑞芯微); Supplier Footprint: CSP-20(1.6x2); JLCPCB Part Class: Extended Part; Datasheet: https://atta.szlcsc.com/upload/public/pdf/source/20240425/5C63A3218BA1DEAD5B7D68991EA91410.pdf; Supplier: LCSC; Function: 降压型; Output Type: 可调; Voltage - Supply: 2.7V~5.5V; Output Voltage: 712.5mV~1.5V; Output Current: 6A; Frequency - Switching: 2.4MHz; Operating Temperature: -40℃~+125℃@(TJ); Synchronous Rectifier: 是; Number of Outputs: 1; Topology: 降压式; Quiescent Current: 70uA; Switch tube (built-in/external): 内置
C216 C217 C254 C255 C273 C274 C288 C289 C298 C299 C307 C308 = CL05A106MP5NUNC: LCSC Part Name: 10uF ±20% 10V; Supplier Part: C315248; Manufacturer: SAMSUNG(三星); Supplier Footprint: 0402; JLCPCB Part Class: Extended Part; Datasheet: https://atta.szlcsc.com/upload/public/pdf/source/20231220/1EF805BAE1520675928CC4638D279E74.pdf; Supplier: LCSC; Tolerance: ±20%; Voltage Rated: 10V; Temperature Coefficient: X5R
C310 = GRM0335C1H100FA01D: LCSC Part Name: 10pF ±1% 50V; Supplier Part: C384956; Manufacturer: muRata(村田); Supplier Footprint: 0201; JLCPCB Part Class: Extended Part; Datasheet: https://atta.szlcsc.com/upload/public/pdf/source/20200305/C490387_23319AE8C154DEB24C505E6C82A8106A.pdf; Supplier: LCSC; Tolerance: ±1%; Voltage Rated: 50V; Temperature Coefficient: C0G
C319 = GRM033R61E104KE14D: LCSC Part Name: 100nF ±10% 25V; Supplier Part: C76939; Manufacturer: muRata(村田); Supplier Footprint: 0201; JLCPCB Part Class: Extended Part; Datasheet: https://atta.szlcsc.com/upload/public/pdf/source/20180307/C76939_15204091018551407727.pdf; Supplier: LCSC; Tolerance: ±10%; Voltage Rating: 25V; Temperature Coefficient: X5R
R29-R32 = RC0201FR-07240RL: LCSC Part Name: 厚膜电阻 240Ω ±1% 50mW; Supplier Part: C155745; Manufacturer: YAGEO(国巨); Supplier Footprint: 0201; JLCPCB Part Class: Extended Part; Datasheet: https://atta.szlcsc.com/upload/public/pdf/source/20181009/C309620_DA5935B6E1D48212CB7A533FE518B3C2.pdf; Supplier: LCSC; Type: 厚膜电阻; Tolerance: ±1%; Power(Watts): 50mW; Overload Voltage (Max): 25V; Temperature Coefficient: ±200ppm/℃; Operating Temperature Range: -55℃~+125℃
R33 R34 R48 = RC0201FR-0722RL: LCSC Part Name: 厚膜电阻 22Ω ±1% 50mW; Supplier Part: C155743; Manufacturer: YAGEO(国巨); Supplier Footprint: 0201; JLCPCB Part Class: Extended Part; Datasheet: https://atta.szlcsc.com/upload/public/pdf/source/20181009/C309620_DA5935B6E1D48212CB7A533FE518B3C2.pdf; Supplier: LCSC; Type: 厚膜电阻; Tolerance: ±1%; Power(Watts): 50mW; Overload Voltage (Max): 25V; Temperature Coefficient: ±200ppm/℃; Operating Temperature Range: -55℃~+125℃
R35 = 0201WMF4702TEE: LCSC Part Name: 47kΩ ±1% 50mW 厚膜电阻; Supplier Part: C270345; Manufacturer: UNI-ROYAL(厚声); Supplier Footprint: 0201; JLCPCB Part Class: Extended Part; Datasheet: https://atta.szlcsc.com/upload/public/pdf/source/20200306/C422600_1E6D84923E4A46A82E41ADD87F860B5C.pdf; Supplier: LCSC; Type: 厚膜电阻; Tolerance: ±1%; Power(Watts): 50mW; Voltage-Supply(Max): 25V; Temperature Coefficient: ±200ppm/℃; Operating Temperature: -55℃~+155℃
U14 U29 = K4UCE3Q4AB-MGCL: Supplier Part: C29073172; Manufacturer: SAMSUNG(三星半导体); Supplier Footprint: FBGA-200(15x10); JLCPCB Part Class: 扩展库; Datasheet: https://atta.szlcsc.com/upload/public/pdf/source/20240712/8AC4BC41411C4EF4EE479FDBAB3EB4C0.pdf; Supplier: LCSC; Memory Format: SDRAM LPDDR4X; Clock Frequency: 2.133GHz; Memory Size: 64Gbit; Voltage - Supply: 1.7V~1.95V; Operating Temperature: -25℃~+85℃
U16 = KLMBG2JETD-B041: Supplier Part: C2803245; Manufacturer: SAMSUNG(三星半导体); Supplier Footprint: FBGA-153; JLCPCB Part Class: Extended Part; Datasheet: https://atta.szlcsc.com/upload/public/pdf/source/20210618/C2803245_EDBEBFDB4ACE4915FC1860DFF1382319.pdf; Supplier: LCSC; Interface Type: eMMC 5.1; Supply Voltage: 2.7V~3.6V; Operating Temperature: -25℃~+85℃; Density: 32GB
U30 = W25Q256JWPIQ: Supplier Part: C5362614; Manufacturer: Winbond(华邦); Supplier Footprint: WSON-8(5x6); JLCPCB Part Class: 扩展库; Datasheet: https://atta.szlcsc.com/upload/public/pdf/source/20230301/B5D5F4178284A9C32ABE670832348C1E.pdf; Supplier: LCSC; Interface: SPI; Memory Size: 256Mbit; Clock Frequency: 133MHz; Voltage - Supply: 1.7V~1.95V; Standby Supply Current: 1uA; Program / Erase Cycles: 100000次; Page Programming Time (Tpp): 800us; Block Erase Time(tBE): 200ms@(64KB); Data Retention - TDR (Year): 20年; Operating Temperature: -40℃~+85℃
B1 = BS-02-A1AJ010: LCSC Part Name: 电池底座 适用电池:CR2032; Supplier Part: C5239862; Manufacturer: MYOUNG(美阳); Supplier Footprint: 插件; JLCPCB Part Class: 扩展库; Datasheet: https://atta.szlcsc.com/upload/public/pdf/source/20221102/8F00F2B23A2A3C447A59C327BBA6C743.pdf; Supplier: LCSC; Connector Type: 电池底座; Battery Type: CR2032; Contact Material: 磷青铜; Contact Plating: 镍; Operating Temperature Range: -25℃~+85℃
C322 C323 = GRM0335C1H180FA01D: LCSC Part Name: 18pF ±1% 50V; Supplier Part: C384967; Manufacturer: muRata(村田); Supplier Footprint: 0201; JLCPCB Part Class: Extended Part; Datasheet: https://atta.szlcsc.com/upload/public/pdf/source/20200305/C490387_23319AE8C154DEB24C505E6C82A8106A.pdf; Supplier: LCSC; Tolerance: ±1%; Voltage Rated: 50V; Temperature Coefficient: C0G
Q1 = AO3400_C181090: LCSC Part Name: 1个N沟道 耐压:30V 电流:5.8A; Supplier Part: C181090; Manufacturer: Hottech(合科泰); Supplier Footprint: SOT-23; JLCPCB Part Class: 扩展库; Datasheet: https://atta.szlcsc.com/upload/public/pdf/source/20220427/6A3871894567E8883DB64081D5FF8011.pdf; Supplier: LCSC; Type: 1个N沟道; Drain Source Voltage (Vdss): 30V; Continuous Drain Current (Id): 5.8A; Power Dissipation (Pd): 350mW; Drain Source On Resistance (RDS(on)@Vgs,Id): 35mΩ@10V,5.8A; Gate Threshold Voltage (Vgs(th)@Id): 1.4V@250uA
U7 = RX8025T-UC: Supplier Part: C53691; Manufacturer: EPSON(爱普生); Supplier Footprint: SOP-14-208mil; JLCPCB Part Class: 扩展库; Datasheet: https://atta.szlcsc.com/upload/public/pdf/source/20160318/1458266987031.pdf; Supplier: LCSC; Interface: I2C; Voltage - Supply: 1.8V~5.5V
U12 U13 = LP5907MFX-3.0/NOPB: LCSC Part Name: 具有低 IQ 和使能功能的 250mA、低噪声、高 PSRR、超低压降稳压器; Supplier Part: C475492; Manufacturer: TI(德州仪器); Supplier Footprint: SOT-23-5; JLCPCB Part Class: 扩展库; Datasheet: https://www.ti.com/cn/lit/gpn/lp5907; Supplier: LCSC; Output Type: 固定; Maximum Input Voltage: 5.5V; Output Voltage: 3V; Output Current: 250mA; Power Supply Rejection Ratio (PSRR): 90dB; Dropout Voltage: 250mV@(250mA); standby current: 25uA; Feature: 防静电保护；短路保护；低ESR；热保护(TSD)；欠压闭锁；带使能; Operating Temperature: -40℃~+125℃; Output Polarity: 正极; Number of Outputs: 1
X1 = X322524MOB4SI: LCSC Part Name: YSX321SL 24MHZ 4P 3225 12PF ±10PPM -40~85℃ (±20PPM); Supplier Part: C70590; Manufacturer: YXC(扬兴晶振); Supplier Footprint: SMD3225-4P; JLCPCB Part Class: 扩展库; Datasheet: https://atta.szlcsc.com/upload/public/pdf/source/20240329/19D5F850207469550BEB00D7DFEDBC7A.pdf; Supplier: LCSC; Type: 贴片晶振; Normal temperature Frequency Tolerance: ±10ppm; Load Capacitance: 12pF; Frequency Stability: ±20ppm; Operating Temperature: -40℃~+85℃

## Nets
+5V: C1.2 C2.2 C3.2 C4.2 C5.2 C6.2 C7.2 C8.2 C9.2 C58.1 C62.2 C64.2 C67.2 C68.2 C83.2 C84.2 C91.2 C92.2 Q1.1(G) U6.1(VCC9) U6.7(VCC8) U6.21(VCCA) U6.22(VCC4) U6.27(VCC10) U6.28(VCC6) U6.33(VCC2) U6.34(VCC2) U6.43(VCC7) U6.44(VCC5) U6.52(VCC1) U6.53(VCC1) U6.54(VCC3) U6.64(VCC12) U8.D1(VIN) U8.D2(VIN) U8.E1(VIN) U8.E2(VIN) U10.D1(VIN) U10.D2(VIN) U10.E1(VIN) U10.E2(VIN) U11.D1(VIN) U11.D2(VIN) U11.E1(VIN) U11.E2(VIN) U12.1(IN) U12.3(EN) ; also on sheet 6 8 9
GND: B1.1 C1.1 C2.1 C3.1 C4.1 C5.1 C6.1 C7.1 C8.1 C9.1 C11.1 C12.1 C13.1 C14.1 C26.1 C27.1 C28.1 C29.1 C31.1 C32.1 C33.1 C34.1 C36.1 C37.1 C38.1 C39.1 C40.1 C41.1 C43.1 C44.1 C45.2 C47.1 C48.1 C49.2 C51.2 C52.1 C53.1 C54.1 C55.1 C56.1 C57.1 C58.2 C59.2 C60.1 C61.1 C62.1 C63.1 C65.1 C67.1 C68.1 C70.1 C71.1 C72.1 C73.1 C74.1 C83.1 C84.1 C86.1 C87.1 C88.1 C89.1 C90.1 C91.1 C92.1 C94.1 C95.1 C96.1 C97.1 C98.1 C191.1 C192.1 C193.2 C200.1 C201.1 C202.1 C203.1 C204.1 C205.1 C206.1 C207.1 C208.1 C209.1 C210.1 C211.1 C212.1 C213.1 C214.1 C215.1 C216.1 C217.1 C218.1 C238.1 C243.1 C244.1 C245.1 C246.1 C247.1 C248.1 C249.1 C250.1 C251.1 C252.1 C253.1 C254.1 C255.1 C256.1 C257.1 C258.1 C259.1 C260.1 C261.1 C262.1 C263.1 C264.1 C265.1 C266.1 C267.1 C268.1 C269.1 C270.1 C271.1 C272.1 C273.1 C274.1 C275.1 C276.1 C277.1 C278.1 C279.1 C280.1 C281.1 C282.1 C283.1 C284.1 C285.1 C286.1 C287.1 C288.1 C289.1 C290.1 C291.1 C292.1 C293.1 C294.1 C295.1 C296.1 C297.1 C298.1 C299.1 C300.1 C301.1 C302.1 C303.1 C304.1 C305.1 C306.1 C307.1 C308.1 C309.1 C310.1 C314.1 C315.1 C316.1 C317.2 C318.1 C319.1 C320.1 C322.1 C323.2 C326.2 C346.2 C347.2 C348.2 C380.2 D1.2(A) D3.1 Q1.2(S) R7.1 R9.1 R11.1 R14.1 R35.1 R45.1 R47.1 SW1.2 U6.69(PAD) U7.11(GND) U8.B2(GND) U8.B3(GND) U8.B4(AGND) U8.C1(GND) U8.C2(GND) U8.C3(GND) U8.C4(GND) U10.B2(GND) U10.B3(GND) U10.B4(AGND) U10.C1(GND) U10.C2(GND) U10.C3(GND) U10.C4(GND) U11.B2(GND) U11.B3(GND) U11.B4(AGND) U11.C1(GND) U11.C2(GND) U11.C3(GND) U11.C4(GND) U12.2(GND) U13.2(GND) U14.A3(VSS) U14.A10(VSS) U14.AB3(VSS) U14.AB5(VSS) U14.AB8(VSS) U14.AB10(VSS) U14.C1(VSS) U14.C5(VSS) U14.C8(VSS) U14.C12(VSS) U14.D2(VSS) U14.D4(VSS) U14.D9(VSS) U14.D11(VSS) U14.E1(VSS) U14.E5(VSS) U14.E8(VSS) U14.E12(VSS) U14.G1(VSS) U14.G2(ODT_CA_a1)/2)) U14.G3(VSS) U14.G5(VSS) U14.G8(VSS) U14.G10(VSS) U14.G12(VSS) U14.J1(VSS) U14.J3(VSS) U14.J10(VSS) U14.J12(VSS) U14.K2(VSS) U14.K4(VSS) U14.K9(VSS) U14.K11(VSS) U14.N2(VSS) U14.N4(VSS) U14.N9(VSS) U14.N11(VSS) U14.P1(VSS) U14.P3(VSS) U14.P10(VSS) U14.P12(VSS) U14.T1(VSS) U14.T2(ODT_CA_b1)/2)) U14.T3(VSS) U14.T5(VSS) U14.T8(VSS) U14.T10(VSS) U14.T12(VSS) U14.V1(VSS) U14.V5(VSS) U14.V8(VSS) U14.V12(VSS) U14.W2(VSS) U14.W4(VSS) U14.W9(VSS) U14.W11(VSS) U14.Y1(VSS) U14.Y5(VSS) U14.Y8(VSS) U14.Y12(VSS) U16.A6(VSS) U16.C4(VSS) U16.E7(VSS) U16.G5(VSS) U16.H10(VSS) U16.J5(VSS) U16.K8(VSS) U16.N2(VSS) U16.N5(VSS) U16.P4(VSS) U16.P6(VSS) U29.A3(VSS) U29.A10(VSS) U29.AB3(VSS) U29.AB5(VSS) U29.AB8(VSS) U29.AB10(VSS) U29.C1(VSS) U29.C5(VSS) U29.C8(VSS) U29.C12(VSS) U29.D2(VSS) U29.D4(VSS) U29.D9(VSS) U29.D11(VSS) U29.E1(VSS) U29.E5(VSS) U29.E8(VSS) U29.E12(VSS) U29.G1(VSS) U29.G2(ODT_CA_a1)/2)) U29.G3(VSS) U29.G5(VSS) U29.G8(VSS) U29.G10(VSS) U29.G12(VSS) U29.J1(VSS) U29.J3(VSS) U29.J10(VSS) U29.J12(VSS) U29.K2(VSS) U29.K4(VSS) U29.K9(VSS) U29.K11(VSS) U29.N2(VSS) U29.N4(VSS) U29.N9(VSS) U29.N11(VSS) U29.P1(VSS) U29.P3(VSS) U29.P10(VSS) U29.P12(VSS) U29.T1(VSS) U29.T2(ODT_CA_b1)/2)) U29.T3(VSS) U29.T5(VSS) U29.T8(VSS) U29.T10(VSS) U29.T12(VSS) U29.V1(VSS) U29.V5(VSS) U29.V8(VSS) U29.V12(VSS) U29.W2(VSS) U29.W4(VSS) U29.W9(VSS) U29.W11(VSS) U29.Y1(VSS) U29.Y5(VSS) U29.Y8(VSS) U29.Y12(VSS) U30.4(GND) U30.9(EP) X1.2(GND) X1.4(GND) ; also on sheet 1 5 6 7 8 9
VCC_1.8V: C54.2 C55.2 C63.2 C291.2 C292.2 C293.2 C294.2 C295.2 C296.2 C297.2 C298.2 C299.2 C300.2 C301.2 C302.2 C303.2 C304.2 C305.2 C306.2 C307.2 C308.2 C314.2 C315.2 C316.2 C317.1 C319.2 C320.2 L9.2 R36.2 R37.2 R38.2 R39.2 R40.2 TP12.1 U6.20(VCCIO) U6.25(VOUT10) U14.F1(VDD1) U14.F12(VDD1) U14.G4(VDD1) U14.G9(VDD1) U14.T4(VDD1) U14.T9(VDD1) U14.U1(VDD1) U14.U12(VDD1) U16.C6(VCCQ) U16.M4(VCCQ) U16.N4(VCCQ) U16.P3(VCCQ) U16.P5(VCCQ) U29.F1(VDD1) U29.F12(VDD1) U29.G4(VDD1) U29.G9(VDD1) U29.T4(VDD1) U29.T9(VDD1) U29.U1(VDD1) U29.U12(VDD1) U30.8(VCC) ; also on sheet 1 5 6
VCC_1.8V_ALT: C191.2 C192.2 TP18.1 U6.58(PLDO2) U6.60(PLDO1) ; also on sheet 1 5 9
VCC_2.0V: C59.1 U6.41(VOUT7) U6.59(VCC11)
VCC_3.3V: C56.2 C57.2 C311.2 C312.2 C313.2 L10.2 R15.2 TP13.1 U6.5(VOUT8) U16.E6(VCC) U16.F5(VCC) U16.J10(VCC) U16.K9(VDDF) ; also on sheet 1 7 8
VCC_3.3V_SD: C326.1 TP19.1 U6.65(PLDO5) ; also on sheet 1
VDD_0.6V: C50.2 C51.1 C52.2 C53.2 C200.2 C201.2 C202.2 C203.2 C204.2 C205.2 C206.2 C207.2 C208.2 C209.2 C210.2 C211.2 C212.2 C213.2 C214.2 C215.2 C216.2 C217.2 C218.2 C257.2 C258.2 C259.2 C260.2 C261.2 C262.2 C263.2 C264.2 C265.2 C266.2 C267.2 C268.2 C269.2 C270.2 C271.2 C272.2 C273.2 C274.2 C275.2 L8.2 R8.2 R29.2 R30.2 R31.2 R32.2 TP11.1 U6.67(VOUT9) U14.AA3(VDDQ) U14.AA5(VDDQ) U14.AA8(VDDQ) U14.AA10(VDDQ) U14.B3(VDDQ) U14.B5(VDDQ) U14.B8(VDDQ) U14.B10(VDDQ) U14.D1(VDDQ) U14.D5(VDDQ) U14.D8(VDDQ) U14.D12(VDDQ) U14.F3(VDDQ) U14.F10(VDDQ) U14.U3(VDDQ) U14.U10(VDDQ) U14.W1(VDDQ) U14.W5(VDDQ) U14.W8(VDDQ) U14.W12(VDDQ) U29.AA3(VDDQ) U29.AA5(VDDQ) U29.AA8(VDDQ) U29.AA10(VDDQ) U29.B3(VDDQ) U29.B5(VDDQ) U29.B8(VDDQ) U29.B10(VDDQ) U29.D1(VDDQ) U29.D5(VDDQ) U29.D8(VDDQ) U29.D12(VDDQ) U29.F3(VDDQ) U29.F10(VDDQ) U29.U3(VDDQ) U29.U10(VDDQ) U29.W1(VDDQ) U29.W5(VDDQ) U29.W8(VDDQ) U29.W12(VDDQ) ; also on sheet 1 5
VDD_0.75V_S0: C346.1 TP4.1 U6.8(NLDO5) ; also on sheet 1 5
VDD_0.75V_S3: C347.1 TP3.1 U6.14(NLDO1) ; also on sheet 1 5
VDD_1.1V: C46.2 C47.2 C48.2 C49.1 C60.2 C61.2 C238.2 C243.2 C244.2 C245.2 C246.2 C247.2 C248.2 C249.2 C250.2 C251.2 C252.2 C253.2 C254.2 C255.2 C256.2 C276.2 C277.2 C278.2 C279.2 C280.2 C281.2 C282.2 C283.2 C284.2 C285.2 C286.2 C287.2 C288.2 C289.2 C290.2 L7.2 R6.2 TP10.1 U6.9(VCC14) U6.13(VCC13) U6.30(VOUT6) U14.A4(VDD2) U14.A9(VDD2) U14.AB4(VDD2) U14.AB9(VDD2) U14.F5(VDD2) U14.F8(VDD2) U14.H1(VDD2) U14.H5(VDD2) U14.H8(VDD2) U14.H12(VDD2) U14.K1(VDD2) U14.K3(VDD2) U14.K10(VDD2) U14.K12(VDD2) U14.N1(VDD2) U14.N3(VDD2) U14.N10(VDD2) U14.N12(VDD2) U14.R1(VDD2) U14.R5(VDD2) U14.R8(VDD2) U14.R12(VDD2) U14.U5(VDD2) U14.U8(VDD2) U29.A4(VDD2) U29.A9(VDD2) U29.AB4(VDD2) U29.AB9(VDD2) U29.F5(VDD2) U29.F8(VDD2) U29.H1(VDD2) U29.H5(VDD2) U29.H8(VDD2) U29.H12(VDD2) U29.K1(VDD2) U29.K3(VDD2) U29.K10(VDD2) U29.K12(VDD2) U29.N1(VDD2) U29.N3(VDD2) U29.N10(VDD2) U29.N12(VDD2) U29.R1(VDD2) U29.R5(VDD2) U29.R8(VDD2) U29.R12(VDD2) U29.U5(VDD2) U29.U8(VDD2) ; also on sheet 1 5
VDD_1.2V: C348.1 TP2.1 U6.57(PLDO3) ; also on sheet 1 5
VDD_2V: C40.2 C41.2 L5.2 TP8.1
VDD_CPU_BIG0: C69.1 C69.2 C70.2 C71.2 C72.2 C73.2 C74.2 L11.2 R13.1 R13.2 TP15.1 U8.A4(VOUT) ; also on sheet 1 5
VDD_CPU_BIG1: C93.1 C93.2 C94.2 C95.2 C96.2 C97.2 C98.2 L14.2 R18.1 R18.2 TP14.1 U11.A4(VOUT) ; also on sheet 1 5
VDD_CPU_LIT: C25.1 C25.2 C26.2 C27.2 C28.2 C29.2 L2.2 R2.1 R2.2 TP5.1 U6.37(VOUT2) ; also on sheet 1 5
VDD_DDR: C42.1 C42.2 C43.2 C44.2 C45.1 L6.2 R5.1 R5.2 TP9.1 U6.46(VOUT5) ; also on sheet 1 5
VDD_DDR_PLL: C193.1 U6.12(NLDO2) ; also on sheet 1 5
VDD_GPU: C10.1 C10.2 C11.2 C12.2 C13.2 C14.2 L1.2 R1.1 R1.2 TP1.1 U6.49(VOUT1) ; also on sheet 1 5
VDD_LOGIC: C30.1 C30.2 C31.2 C32.2 C33.2 C34.2 L3.2 R3.1 R3.2 TP6.1 U6.56(VOUT3) ; also on sheet 1 5
VDD_NPU: C85.1 C85.2 C86.2 C87.2 C88.2 C89.2 C90.2 L13.2 R17.1 R17.2 TP16.1 U10.A4(VOUT) ; also on sheet 1 5
VDD_VDENC: C35.1 C35.2 C36.2 C37.2 C38.2 C39.2 L4.2 R4.1 R4.2 TP7.1 U6.24(VOUT4) ; also on sheet 1 5
BAT_PWR: B1.2 R19.2 U13.1(IN)
BUCK1_LX: L11.1 U8.D3(LX) U8.D4(LX) U8.E3(LX) U8.E4(LX)
BUCK2_LX: L14.1 U11.D3(LX) U11.D4(LX) U11.E3(LX) U11.E4(LX)
BUCK3_LX: L13.1 U10.D3(LX) U10.D4(LX) U10.E3(LX) U10.E4(LX)
BUCK_EN: R14.2 R15.1 U8.A2(EN) U10.A2(EN) U11.A2(EN)
CH0_A0_A: U14.H2(CA0_a) ; also on sheet 1
CH0_A0_B: U14.R2(CA0_b) ; also on sheet 1
CH0_A1_A: U14.J2(CA1_a) ; also on sheet 1
CH0_A1_B: U14.P2(CA1_b) ; also on sheet 1
CH0_A2_A: U14.H9(CA2_a) ; also on sheet 1
CH0_A2_B: U14.R9(CA2_b) ; also on sheet 1
CH0_A3_A: U14.H10(CA3_a) ; also on sheet 1
CH0_A3_B: U14.R10(CA3_b) ; also on sheet 1
CH0_A4_A: U14.H11(CA4_a) ; also on sheet 1
CH0_A4_B: U14.R11(CA4_b) ; also on sheet 1
CH0_A5_A: U14.J11(CA5_a) ; also on sheet 1
CH0_A5_B: U14.P11(CA5_b) ; also on sheet 1
CH0_CK_A: U14.J8(CK_t_a) ; also on sheet 1
CH0_CK_B: U14.P8(CK_t_b) ; also on sheet 1
CH0_CKB_A: U14.J9(CK_c_a) ; also on sheet 1
CH0_CKB_B: U14.P9(CK_c_b) ; also on sheet 1
CH0_CKE0_A: U14.J4(CKE0_a) ; also on sheet 1
CH0_CKE0_B: U14.P4(CKE0_b) ; also on sheet 1
CH0_CKE1_A: U14.J5(CKE1_a) ; also on sheet 1
CH0_CKE1_B: U14.P5(CKE1_b) ; also on sheet 1
CH0_CS0_A: U14.H4(CS0_a) ; also on sheet 1
CH0_CS0_B: U14.R4(CS0_b) ; also on sheet 1
CH0_CS1_A: U14.H3(CS1_a) ; also on sheet 1
CH0_CS1_B: U14.R3(CS1_b) ; also on sheet 1
CH0_DM0_A: U14.C3(DMI0_a) ; also on sheet 1
CH0_DM0_B: U14.Y3(DMI0_b) ; also on sheet 1
CH0_DM1_A: U14.C10(DMI1_a) ; also on sheet 1
CH0_DM1_B: U14.Y10(DMI1_b) ; also on sheet 1
CH0_DQ0_A: U14.B2(DQ0_a) ; also on sheet 1
CH0_DQ0_B: U14.AA2(DQ0_b) ; also on sheet 1
CH0_DQ1_A: U14.C2(DQ1_a) ; also on sheet 1
CH0_DQ1_B: U14.Y2(DQ1_b) ; also on sheet 1
CH0_DQ2_A: U14.E2(DQ2_a) ; also on sheet 1
CH0_DQ2_B: U14.V2(DQ2_b) ; also on sheet 1
CH0_DQ3_A: U14.F2(DQ3_a) ; also on sheet 1
CH0_DQ3_B: U14.U2(DQ3_b) ; also on sheet 1
CH0_DQ4_A: U14.F4(DQ4_a) ; also on sheet 1
CH0_DQ4_B: U14.U4(DQ4_b) ; also on sheet 1
CH0_DQ5_A: U14.E4(DQ5_a) ; also on sheet 1
CH0_DQ5_B: U14.V4(DQ5_b) ; also on sheet 1
CH0_DQ6_A: U14.C4(DQ6_a) ; also on sheet 1
CH0_DQ6_B: U14.Y4(DQ6_b) ; also on sheet 1
CH0_DQ7_A: U14.B4(DQ7_a) ; also on sheet 1
CH0_DQ7_B: U14.AA4(DQ7_b) ; also on sheet 1
CH0_DQ8_A: U14.B11(DQ8_a) ; also on sheet 1
CH0_DQ8_B: U14.AA11(DQ8_b) ; also on sheet 1
CH0_DQ9_A: U14.C11(DQ9_a) ; also on sheet 1
CH0_DQ9_B: U14.Y11(DQ9_b) ; also on sheet 1
CH0_DQ10_A: U14.E11(DQ10_a) ; also on sheet 1
CH0_DQ10_B: U14.V11(DQ10_b) ; also on sheet 1
CH0_DQ11_A: U14.F11(DQ11_a) ; also on sheet 1
CH0_DQ11_B: U14.U11(DQ11_b) ; also on sheet 1
CH0_DQ12_A: U14.F9(DQ12_a) ; also on sheet 1
CH0_DQ12_B: U14.U9(DQ12_b) ; also on sheet 1
CH0_DQ13_A: U14.E9(DQ13_a) ; also on sheet 1
CH0_DQ13_B: U14.V9(DQ13_b) ; also on sheet 1
CH0_DQ14_A: U14.C9(DQ14_a) ; also on sheet 1
CH0_DQ14_B: U14.Y9(DQ14_b) ; also on sheet 1
CH0_DQ15_A: U14.B9(DQ15_a) ; also on sheet 1
CH0_DQ15_B: U14.AA9(DQ15_b) ; also on sheet 1
CH0_DQS0N_A: U14.E3(DQS0_c_a) ; also on sheet 1
CH0_DQS0N_B: U14.V3(DQS0_c_b) ; also on sheet 1
CH0_DQS0P_A: U14.D3(DQS0_t_a) ; also on sheet 1
CH0_DQS0P_B: U14.W3(DQS0_t_b) ; also on sheet 1
CH0_DQS1N_A: U14.E10(DQS1_c_a) ; also on sheet 1
CH0_DQS1N_B: U14.V10(DQS1_c_b) ; also on sheet 1
CH0_DQS1P_A: U14.D10(DQS1_t_a) ; also on sheet 1
CH0_DQS1P_B: U14.W10(DQS1_t_b) ; also on sheet 1
CH0_RST: U14.T11(RESET_n) ; also on sheet 1
CH0_ZQ0: R29.1 U14.A5(ZQ0) ; also on sheet 1
CH0_ZQ1: R30.1 U14.A8(ZQ1) ; also on sheet 1
CH1_A0_C: U29.H2(CA0_a) ; also on sheet 1
CH1_A0_D: U29.R2(CA0_b) ; also on sheet 1
CH1_A1_C: U29.J2(CA1_a) ; also on sheet 1
CH1_A1_D: U29.P2(CA1_b) ; also on sheet 1
CH1_A2_C: U29.H9(CA2_a) ; also on sheet 1
CH1_A2_D: U29.R9(CA2_b) ; also on sheet 1
CH1_A3_C: U29.H10(CA3_a) ; also on sheet 1
CH1_A3_D: U29.R10(CA3_b) ; also on sheet 1
CH1_A4_C: U29.H11(CA4_a) ; also on sheet 1
CH1_A4_D: U29.R11(CA4_b) ; also on sheet 1
CH1_A5_C: U29.J11(CA5_a) ; also on sheet 1
CH1_A5_D: U29.P11(CA5_b) ; also on sheet 1
CH1_CK_C: U29.J8(CK_t_a) ; also on sheet 1
CH1_CK_D: U29.P8(CK_t_b) ; also on sheet 1
CH1_CKB_C: U29.J9(CK_c_a) ; also on sheet 1
CH1_CKB_D: U29.P9(CK_c_b) ; also on sheet 1
CH1_CKE0_C: U29.J4(CKE0_a) ; also on sheet 1
CH1_CKE0_D: U29.P4(CKE0_b) ; also on sheet 1
CH1_CKE1_C: U29.J5(CKE1_a) ; also on sheet 1
CH1_CKE1_D: U29.P5(CKE1_b) ; also on sheet 1
CH1_CS0_C: U29.H4(CS0_a) ; also on sheet 1
CH1_CS0_D: U29.R4(CS0_b) ; also on sheet 1
CH1_CS1_C: U29.H3(CS1_a) ; also on sheet 1
CH1_CS1_D: U29.R3(CS1_b) ; also on sheet 1
CH1_DM0_C: U29.C3(DMI0_a) ; also on sheet 1
CH1_DM0_D: U29.Y3(DMI0_b) ; also on sheet 1
CH1_DM1_C: U29.C10(DMI1_a) ; also on sheet 1
CH1_DM1_D: U29.Y10(DMI1_b) ; also on sheet 1
CH1_DQ0_C: U29.B2(DQ0_a) ; also on sheet 1
CH1_DQ0_D: U29.AA2(DQ0_b) ; also on sheet 1
CH1_DQ1_C: U29.C2(DQ1_a) ; also on sheet 1
CH1_DQ1_D: U29.Y2(DQ1_b) ; also on sheet 1
CH1_DQ2_C: U29.E2(DQ2_a) ; also on sheet 1
CH1_DQ2_D: U29.V2(DQ2_b) ; also on sheet 1
CH1_DQ3_C: U29.F2(DQ3_a) ; also on sheet 1
CH1_DQ3_D: U29.U2(DQ3_b) ; also on sheet 1
CH1_DQ4_C: U29.F4(DQ4_a) ; also on sheet 1
CH1_DQ4_D: U29.U4(DQ4_b) ; also on sheet 1
CH1_DQ5_C: U29.E4(DQ5_a) ; also on sheet 1
CH1_DQ5_D: U29.V4(DQ5_b) ; also on sheet 1
CH1_DQ6_C: U29.C4(DQ6_a) ; also on sheet 1
CH1_DQ6_D: U29.Y4(DQ6_b) ; also on sheet 1
CH1_DQ7_C: U29.B4(DQ7_a) ; also on sheet 1
CH1_DQ7_D: U29.AA4(DQ7_b) ; also on sheet 1
CH1_DQ8_C: U29.B11(DQ8_a) ; also on sheet 1
CH1_DQ8_D: U29.AA11(DQ8_b) ; also on sheet 1
CH1_DQ9_C: U29.C11(DQ9_a) ; also on sheet 1
CH1_DQ9_D: U29.Y11(DQ9_b) ; also on sheet 1
CH1_DQ10_C: U29.E11(DQ10_a) ; also on sheet 1
CH1_DQ10_D: U29.V11(DQ10_b) ; also on sheet 1
CH1_DQ11_C: U29.F11(DQ11_a) ; also on sheet 1
CH1_DQ11_D: U29.U11(DQ11_b) ; also on sheet 1
CH1_DQ12_C: U29.F9(DQ12_a) ; also on sheet 1
CH1_DQ12_D: U29.U9(DQ12_b) ; also on sheet 1
CH1_DQ13_C: U29.E9(DQ13_a) ; also on sheet 1
CH1_DQ13_D: U29.V9(DQ13_b) ; also on sheet 1
CH1_DQ14_C: U29.C9(DQ14_a) ; also on sheet 1
CH1_DQ14_D: U29.Y9(DQ14_b) ; also on sheet 1
CH1_DQ15_C: U29.B9(DQ15_a) ; also on sheet 1
CH1_DQ15_D: U29.AA9(DQ15_b) ; also on sheet 1
CH1_DQS0N_C: U29.E3(DQS0_c_a) ; also on sheet 1
CH1_DQS0N_D: U29.V3(DQS0_c_b) ; also on sheet 1
CH1_DQS0P_C: U29.D3(DQS0_t_a) ; also on sheet 1
CH1_DQS0P_D: U29.W3(DQS0_t_b) ; also on sheet 1
CH1_DQS1N_C: U29.E10(DQS1_c_a) ; also on sheet 1
CH1_DQS1N_D: U29.V10(DQS1_c_b) ; also on sheet 1
CH1_DQS1P_C: U29.D10(DQS1_t_a) ; also on sheet 1
CH1_DQS1P_D: U29.W10(DQS1_t_b) ; also on sheet 1
CH1_RST: U29.T11(RESET_n) ; also on sheet 1
CH1_ZQ0: R31.1 U29.A5(ZQ0) ; also on sheet 1
CH1_ZQ1: R32.1 U29.A8(ZQ1) ; also on sheet 1
CPU_BIG0_VSEL: U8.A1(VSEL) ; also on sheet 1
CPU_BIG1_SDA: U11.B1(SDA)
CPU_BIG1_VSEL: U11.A1(VSEL) ; also on sheet 1
EMMC_CLK: R33.1 ; also on sheet 1
EMMC_CMD: R38.1 U16.M5(CMD) ; also on sheet 1
EMMC_D0: R37.1 U16.A3(DAT0) ; also on sheet 1
EMMC_D1: U16.A4(DAT1) ; also on sheet 1
EMMC_D2: U16.A5(DAT2) ; also on sheet 1
EMMC_D3: U16.B2(DAT3) ; also on sheet 1
EMMC_D4: U16.B3(DAT4) ; also on sheet 1
EMMC_D5: U16.B4(DAT5) ; also on sheet 1
EMMC_D6: U16.B5(DAT6) ; also on sheet 1
EMMC_D7: U16.B6(DAT7) ; also on sheet 1
EMMC_DS: R34.1 R35.2 ; also on sheet 1
EMMC_RST: C309.2 C310.2 R36.1 U16.K5(RSTN) ; also on sheet 1
EXT_BUCK_SCL: U8.A3(SCL) U11.A3(SCL)
EXT_BUCK_SDA: U8.B1(SDA)
FLASH_CLK: U30.6(CLK) ; also on sheet 1
FLASH_CS: U30.1(CS#) ; also on sheet 1
FLASH_IO0: U30.5(DI(IO0)) ; also on sheet 1
FLASH_IO1: U30.2(DO(IO1)) ; also on sheet 1
FLASH_IO2: U30.3(WP#(IO2)) ; also on sheet 1
FLASH_IO3: U30.7(HOLD#orRESET#(IO3)) ; also on sheet 1
HDMI_0.85V: C380.1 TP24.1 U6.11(NLDO3) ; also on sheet 1 5
NPU_SCL: U10.A3(SCL)
NPU_SDA: U10.B1(SDA)
NPU_VSEL: U10.A1(VSEL) ; also on sheet 1
PMIC_FB6: C46.1 R6.1 R7.2 U6.31(FB6)
PMIC_FB9: C50.1 R8.1 R9.2 U6.66(FB9)
PMIC_INT: R39.1 U6.19(INT) ; also on sheet 1
PMIC_PWR_CTRL2: R44.1 U6.61(PWRCRTL2)
PMIC_PWR_CTRL3: R46.1 U6.16(MISO/PWRCRTL3)
PMIC_PWRCTRL1: U6.62(PWRCRTL1) ; also on sheet 1
PMIC_PWRCTRL2: R44.2 R45.2
PMIC_PWRCTRL3: R46.2 R47.2 ; also on sheet 1
PMIC_PWRON: C318.2 D3.2 SW1.1 U6.4(PWRON)
PMIC_RESET: R40.1
PMIC_SPI_CLK: U6.17(CLK/SCL) ; also on sheet 1
PMIC_SPI_CS: U6.18(CS) ; also on sheet 1
PMIC_SPI_MOSI: U6.15(MOSI/SDA) ; also on sheet 1
PMIC_SW1: L1.1 U6.50(SW1) U6.51(SW1)
PMIC_SW2: L2.1 U6.35(SW2) U6.36(SW2)
PMIC_SW3: L3.1 U6.55(SW3)
PMIC_SW4: L4.1 U6.23(SW4)
PMIC_SW5: L6.1 U6.45(SW5)
PMIC_SW6: L7.1 U6.29(SW6)
PMIC_SW7: L5.1 U6.42(SW7)
PMIC_SW8: L10.1 U6.6(SW8)
PMIC_SW9: L8.1 U6.68(SW9)
PMIC_SW10: L9.1 U6.26(SW10)
PMIC_VDC: C65.2 R10.1 R11.2 R12.2 U6.32(VDC)
RTC32K_OUT: U7.3(FOUT) ; also on sheet 1
RTC_INT: C66.1 U7.10(INT#)
RTC_SCL: U7.2(SCL)
RTC_SDA: U7.13(SDA)
SOC_RESET: U6.40(RESETB) ; also on sheet 1
XIN: C322.2 X1.1(OSC1) ; also on sheet 1
XOUT: R48.2 ; also on sheet 1
$2N12575: R33.2 U16.M6(CLK)
$2N12629: R34.2 U16.H5(DataStrobe)
$2N23474: C311.1 C312.1 C313.1
$3N460: U7.6(VDD) U7.7(FOE) U12.5(OUT) U13.5(OUT)
$3N464: Q1.3(D) R19.1 U13.3(EN)
$3N2919: C323.1 R48.1 X1.3(OSC2)
$4N13638: C66.2 R12.1
$4N13648: C64.1 D1.1(K) R10.2

Not connected (* = marked no-connect by the designer): TP17 1; U6 2(SYNC)* 3(SYNC_CLK)* 10(NLDO4) 38(FB2)* 39(EXT_EN)* 47(FB5)* 48(FB1)* 63(PLDO4); U7 1(T1)* 4(NC)* 5(TEST)* 8(NC)* 9(NC)* 12(T2)* 14(NC)*; U12 4(N/C)*; U13 4(N/C)*; U14 A1(DNU)* A2(DNU)* A11(DNU)* A12(DNU)* AA1(DNU)* AA12(DNU)* AB1(DNU)* AB2(DNU)* AB11(DNU)* AB12(DNU)* B1(DNU)* B12(DNU)* G11(DNU)* K5(DNU)* K8(DNU)* N5(DNU)* N8(DNU)*; U16 A1(NC)* A2(NC)* A7(RFU)* A8(NC)* A9(NC)* A10(NC)* A11(NC)* A12(NC)* A13(NC)* A14(NC)* B1(NC)* B7(NC)* B8(NC)* B9(NC)* B10(NC)* B11(NC)* B12(NC)* B13(NC)* B14(NC)* C1(NC)* C2(VDDI)* C3(NC)* C5(NC)* C7(NC)* C8(NC)* C9(NC)* C10(NC)* C11(NC)* C12(NC)* C13(NC)* C14(NC)* D1(NC)* D2(NC)* D3(NC)* D4(NC)* D12(NC)* D13(NC)* D14(NC)* E1(NC)* E2(NC)* E3(NC)* E5(RFU)* E8(RFU)* E9(RFU)* E10(RFU)* E12(NC)* E13(NC)* E14(NC)* F1(NC)* F2(NC)* F3(NC)* F10(RFU)* F12(NC)* F13(NC)* F14(NC)* G1(NC)* G2(NC)* G3(RFU)* G10(RFU)* G12(NC)* G13(NC)* G14(NC)* H1(NC)* H2(NC)* H3(NC)* H12(NC)* H13(NC)* H14(NC)* J1(NC)* J2(NC)* J3(NC)* J12(NC)* J13(NC)* J14(NC)* K1(NC)* K2(NC)* K3(NC)* K6(RFU)* K7(RFU)* K10(RFU)* K12(NC)* K13(NC)* K14(NC)* L1(NC)* L2(NC)* L3(NC)* L12(NC)* L13(NC)* L14(NC)* M1(NC)* M2(NC)* M3(NC)* M7(NC)* M8(NC)* M9(NC)* M10(NC)* M11(NC)* M12(NC)* M13(NC)* M14(NC)* N1(NC)* N3(NC)* N6(NC)* N7(NC)* N8(NC)* N9(NC)* N10(NC)* N11(NC)* N12(NC)* N13(NC)* N14(NC)* P1(NC)* P2(NC)* P7(RFU)* P8(NC)* P9(NC)* P10(RFU)* P11(NC)* P12(NC)* P13(NC)* P14(NC)*; U29 A1(DNU)* A2(DNU)* A11(DNU)* A12(DNU)* AA1(DNU)* AA12(DNU)* AB1(DNU)* AB2(DNU)* AB11(DNU)* AB12(DNU)* B1(DNU)* B12(DNU)* G11(DNU)* K5(DNU)* K8(DNU)* N5(DNU)* N8(DNU)*

## Notes on the sheets
sheet 2
- Place between U14 and SoC
- Place between U29 and SoC
- R33 and R34 shall be on SoC side
- A0-A5 Should be equal length
- A0-A5 Should be equal length
- DQS should be equal length to corresponding DQ lines
  (DQS0-DQ0-7 DQS1-DQ8-15)
- DQS should be equal length to corresponding DQ lines
  (DQS0-DQ0-7 DQS1-DQ8-15)
- DQ0-7, DQ 8-15 Should be equal length within the group
- DQ0-7, DQ 8-15 Should be equal length within the group
- DRAM, eMMC and SPI NOR Flash
sheet 3
- RTC IC&PWR
sheet 4
- S0 Rail
- S0 Rail
- S0 Rail
- S0 Rail
- S0 Rail
- 2.0V
- S3
- 0.8V
- S0 Rail
- VCC13 14 Decoupling
- DDR VDD2 1.1V
- S3
- VCCIO Decoupling
- DDR VDDQ 0.6V
- S0 Rail
- S3
- S3
- Main Power ICs
